# EasyEDA Pro project RealisticPM_2026-10-08.epro, board PCB
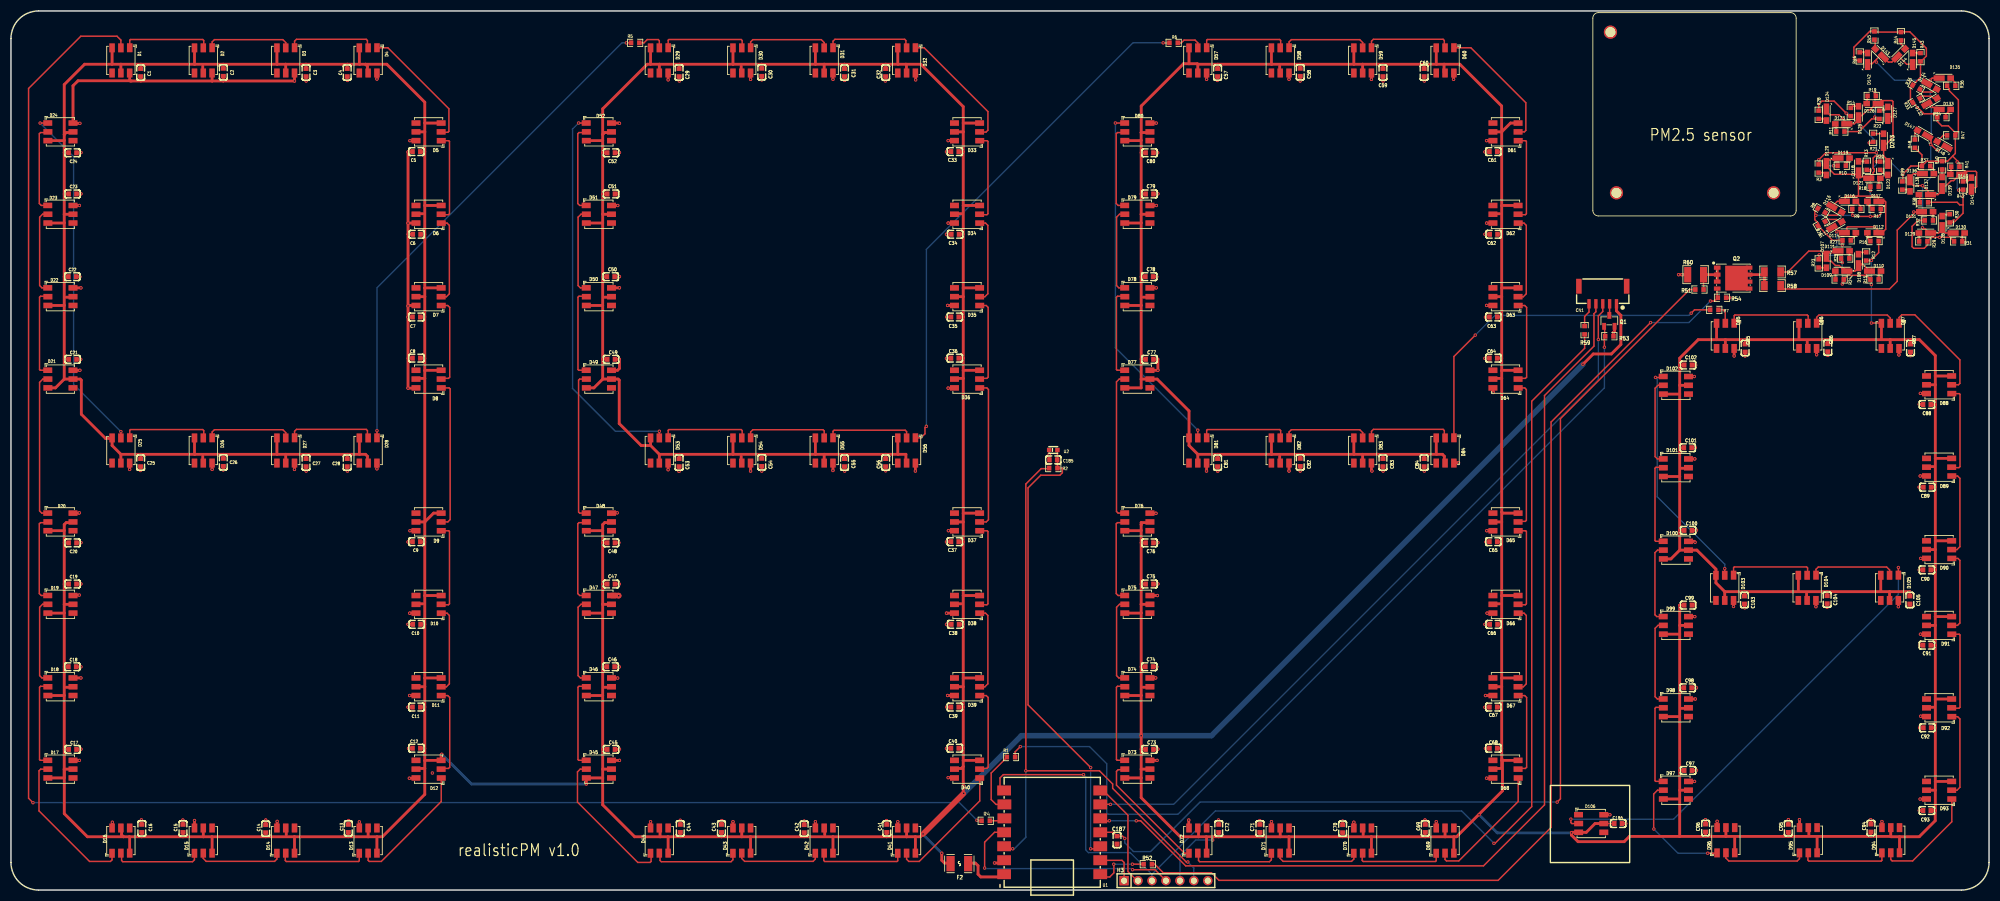
[diagram p4: board, top side]
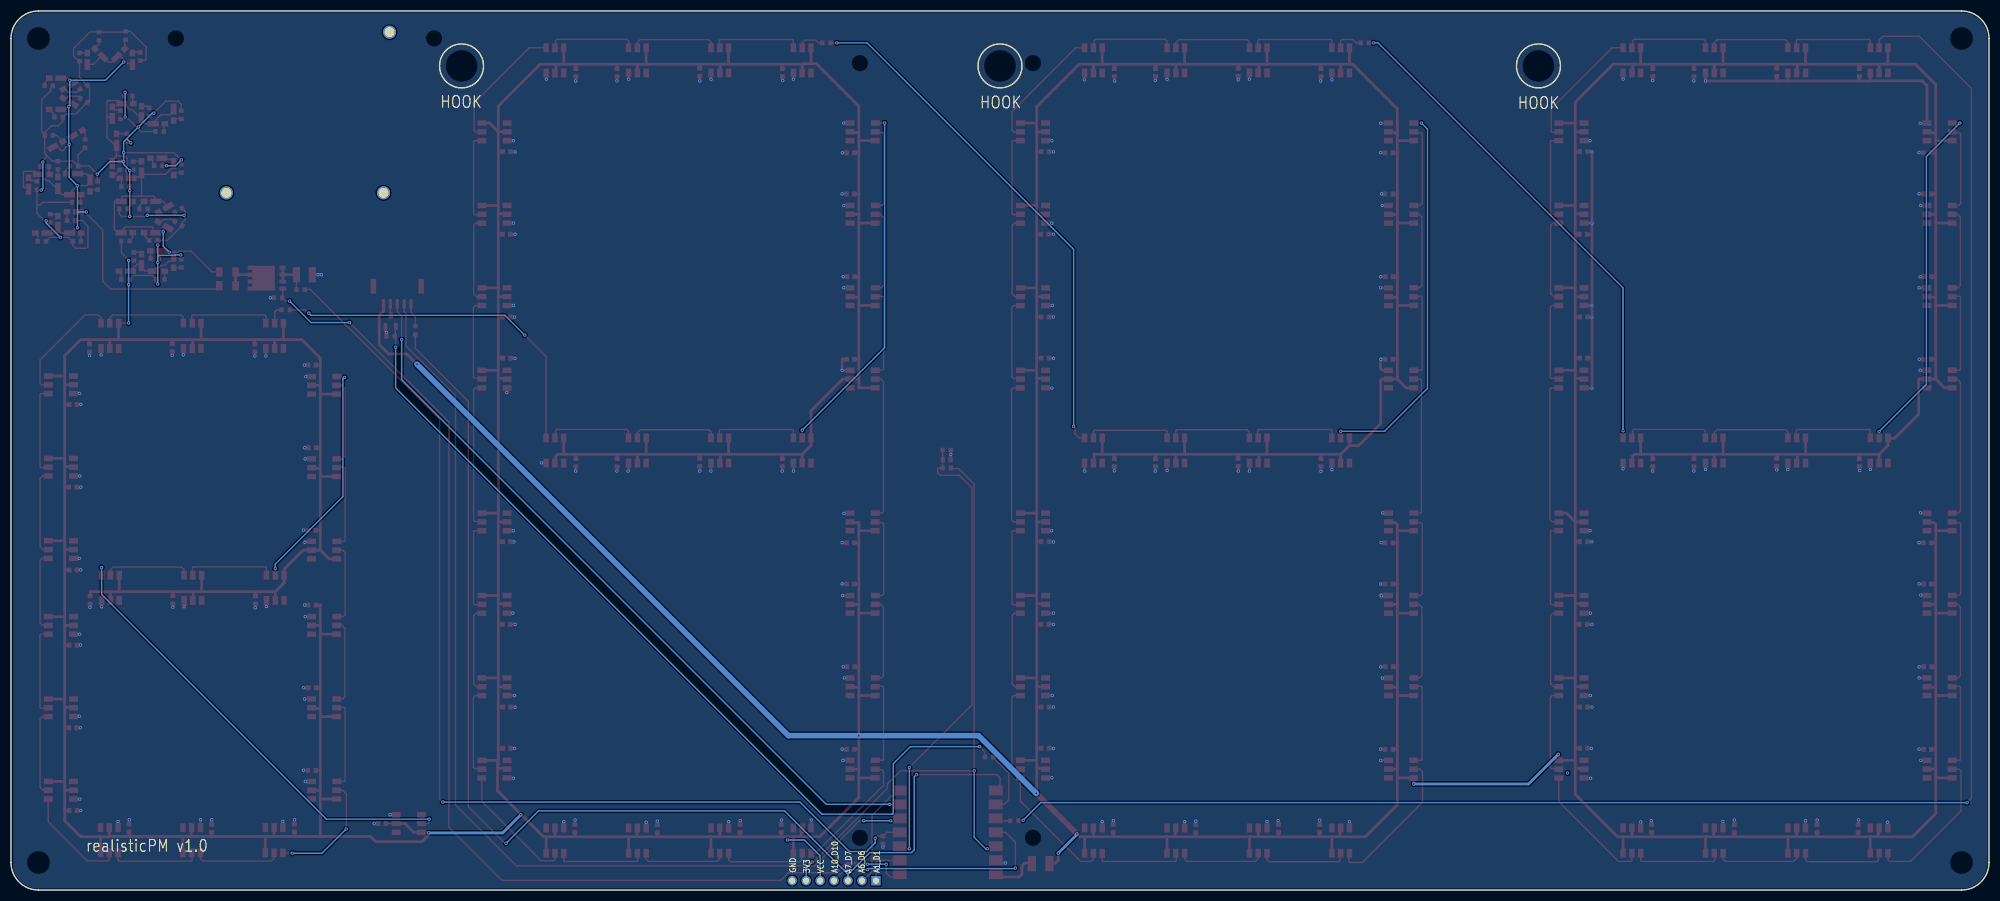
[diagram p5: board, bottom side, seen from below]

Outline 360 x 160 mm; copper layers: Top Layer, Bottom Layer. Coordinates in mm from the lower left corner of the outline.
Outline path: 0,155 0,5 arc(1.46,1.46) 5,0 355,0 arc(358.54,1.46) 360,5 360,155 arc(358.54,158.54) 355,160 5,160 arc(1.46,158.54) 0,155
Stack: Top Layer 0.035mm / Dielectric1 1.51mm FR4 er 4.5 / Bottom Layer 0.035mm

## Design rules (mm)
spacing copperThickness1oz (default): track to track 0.102, other pairs 0.152 to 0.3
spacing copperThickness2oz: track to track 0.203, other pairs 0.152 to 0.3
spacing Plane_innerPlane: track to track 0.102, other pairs 0.152 to 0.3
spacing Copper_copperRegion: track to track 0.102, other pairs 0.152 to 0.3
track width copperThickness1oz (default): min 0.127, default 0.254, max 2.54
track width copperThickness2oz: min 0.203, default 0.254, max 2.54
differential pair differentialPair (default): width min 0.127, default 0.254, max 2.54; gap min 0.152, default 0.152
pour e2951 uses Copper_copperRegion

## Placement (name value [footprint] x y rotation side)
C1  100nF  [C0603]  23.6 148.78 270 top
C2  100nF  [C0603]  38.64 148.84 270 top
C3  100nF  [C0603]  53.7 148.78 270 top
C4  100nF  [C0603]  61.19 148.78 270 top
C5  100nF  [C0603]  73.78 134.4 180 top
C6  100nF  [C0603]  73.84 119.36 180 top
C7  100nF  [C0603]  73.78 104.3 180 top
C8  100nF  [C0603]  73.78 96.81 180 top
C9  100nF  [C0603]  73.78 63.4 180 top
C10  100nF  [C0603]  73.84 48.36 180 top
C11  100nF  [C0603]  73.78 33.3 180 top
C12  100nF  [C0603]  73.78 25.81 180 top
C13  100nF  [C0603]  61.4 11.22 90 top
C14  100nF  [C0603]  46.36 11.16 90 top
C15  100nF  [C0603]  31.3 11.22 90 top
C16  100nF  [C0603]  23.81 11.22 90 top
C17  100nF  [C0603]  11.21 25.6 0 top
C18  100nF  [C0603]  11.16 40.64 0 top
C19  100nF  [C0603]  11.21 55.7 0 top
C20  100nF  [C0603]  11.21 63.19 0 top
C21  100nF  [C0603]  11.21 96.6 0 top
C22  100nF  [C0603]  11.16 111.64 0 top
C23  100nF  [C0603]  11.21 126.7 0 top
C24  100nF  [C0603]  11.21 134.19 0 top
C25  100nF  [C0603]  23.6 77.78 270 top
C26  100nF  [C0603]  38.64 77.84 270 top
C27  100nF  [C0603]  53.7 77.78 270 top
C28  100nF  [C0603]  61.19 77.78 270 top
C29  100nF  [C0603]  121.6 148.78 270 top
C30  100nF  [C0603]  136.64 148.84 270 top
C31  100nF  [C0603]  151.7 148.78 270 top
C32  100nF  [C0603]  159.19 148.78 270 top
C33  100nF  [C0603]  171.78 134.4 180 top
C34  100nF  [C0603]  171.84 119.36 180 top
C35  100nF  [C0603]  171.78 104.3 180 top
C36  100nF  [C0603]  171.78 96.81 180 top
C37  100nF  [C0603]  171.78 63.4 180 top
C38  100nF  [C0603]  171.84 48.36 180 top
C39  100nF  [C0603]  171.78 33.3 180 top
C40  100nF  [C0603]  171.78 25.81 180 top
C41  100nF  [C0603]  159.4 11.22 90 top
C42  100nF  [C0603]  144.36 11.16 90 top
C43  100nF  [C0603]  129.3 11.22 90 top
C44  100nF  [C0603]  121.81 11.22 90 top
C45  100nF  [C0603]  109.22 25.6 0 top
C46  100nF  [C0603]  109.16 40.64 0 top
C47  100nF  [C0603]  109.22 55.7 0 top
C48  100nF  [C0603]  109.22 63.19 0 top
C49  100nF  [C0603]  109.22 96.6 0 top
C50  100nF  [C0603]  109.16 111.64 0 top
C51  100nF  [C0603]  109.22 126.7 0 top
C52  100nF  [C0603]  109.22 134.19 0 top
C53  100nF  [C0603]  121.6 77.78 270 top
C54  100nF  [C0603]  136.64 77.84 270 top
C55  100nF  [C0603]  151.7 77.78 270 top
C56  100nF  [C0603]  159.19 77.78 270 top
C57  100nF  [C0603]  219.6 148.78 270 top
C58  100nF  [C0603]  234.64 148.84 270 top
C59  100nF  [C0603]  249.7 148.78 270 top
C60  100nF  [C0603]  257.19 148.78 270 top
C61  100nF  [C0603]  269.78 134.4 180 top
C62  100nF  [C0603]  269.84 119.36 180 top
C63  100nF  [C0603]  269.78 104.3 180 top
C64  100nF  [C0603]  269.78 96.81 180 top
C65  100nF  [C0603]  269.78 63.4 180 top
C66  100nF  [C0603]  269.84 48.36 180 top
C67  100nF  [C0603]  269.78 33.3 180 top
C68  100nF  [C0603]  269.78 25.81 180 top
C69  100nF  [C0603]  257.4 11.22 90 top
C70  100nF  [C0603]  242.36 11.16 90 top
C71  100nF  [C0603]  227.3 11.22 90 top
C72  100nF  [C0603]  219.81 11.22 90 top
C73  100nF  [C0603]  207.22 25.6 0 top
C74  100nF  [C0603]  207.16 40.64 0 top
C75  100nF  [C0603]  207.22 55.7 0 top
C76  100nF  [C0603]  207.22 63.19 0 top
C77  100nF  [C0603]  207.22 96.6 0 top
C78  100nF  [C0603]  207.16 111.64 0 top
C79  100nF  [C0603]  207.22 126.7 0 top
C80  100nF  [C0603]  207.22 134.19 0 top
C81  100nF  [C0603]  219.6 77.78 270 top
C82  100nF  [C0603]  234.64 77.84 270 top
C83  100nF  [C0603]  249.7 77.78 270 top
C84  100nF  [C0603]  257.19 77.78 270 top
C85  100nF  [C0603]  315.61 98.65 270 top
C86  100nF  [C0603]  330.66 98.71 270 top
C87  100nF  [C0603]  345.71 98.65 270 top
C88  100nF  [C0603]  348.7 88.37 180 top
C89  100nF  [C0603]  348.76 73.32 180 top
C90  100nF  [C0603]  348.7 58.27 180 top
C91  100nF  [C0603]  348.7 44.57 180 top
C92  100nF  [C0603]  348.76 29.52 180 top
C93  100nF  [C0603]  348.7 14.47 180 top
C94  100nF  [C0603]  338.52 11.28 90 top
C95  100nF  [C0603]  323.47 11.22 90 top
C96  100nF  [C0603]  308.42 11.28 90 top
C97  100nF  [C0603]  305.23 21.76 0 top
C98  100nF  [C0603]  305.17 36.81 0 top
C99  100nF  [C0603]  305.23 51.86 0 top
C100  100nF  [C0603]  305.23 65.46 0 top
C101  100nF  [C0603]  305.17 80.51 0 top
C102  100nF  [C0603]  305.23 95.56 0 top
C103  100nF  [C0603]  315.5 52.78 270 top
C104  100nF  [C0603]  330.54 52.84 270 top
C105  100nF  [C0603]  345.6 52.78 270 top
C185  100nF  [C0603]  189.7 78.3 0 top
C186  100nF  [C0603]  292.5 12.1 0 top
C187  100nF  [C0603]  201.3 9.1 90 top
CN1  SM05B-GHS-TB  [CONN-SMD_5P-P1.25_SM05B-GHS-TB]  289.7 108.3 180 top
D1  IN-PI55TBTPRPGPB  [LED-SMD_6P-L5.0-W5.0-P1.60-LS5.4_A-SC5050ARGBC-B01-03-1T]  20 151 270 top
D2  IN-PI55TBTPRPGPB  [LED-SMD_6P-L5.0-W5.0-P1.60-LS5.4_A-SC5050ARGBC-B01-03-1T]  35 151 270 top
D3  IN-PI55TBTPRPGPB  [LED-SMD_6P-L5.0-W5.0-P1.60-LS5.4_A-SC5050ARGBC-B01-03-1T]  50 151 270 top
D4  IN-PI55TBTPRPGPB  [LED-SMD_6P-L5.0-W5.0-P1.60-LS5.4_A-SC5050ARGBC-B01-03-1T]  65 151 270 top
D5  IN-PI55TBTPRPGPB  [LED-SMD_6P-L5.0-W5.0-P1.60-LS5.4_A-SC5050ARGBC-B01-03-1T]  76 138 180 top
D6  IN-PI55TBTPRPGPB  [LED-SMD_6P-L5.0-W5.0-P1.60-LS5.4_A-SC5050ARGBC-B01-03-1T]  76 123 180 top
D7  IN-PI55TBTPRPGPB  [LED-SMD_6P-L5.0-W5.0-P1.60-LS5.4_A-SC5050ARGBC-B01-03-1T]  76 108 180 top
D8  IN-PI55TBTPRPGPB  [LED-SMD_6P-L5.0-W5.0-P1.60-LS5.4_A-SC5050ARGBC-B01-03-1T]  76 93 180 top
D9  IN-PI55TBTPRPGPB  [LED-SMD_6P-L5.0-W5.0-P1.60-LS5.4_A-SC5050ARGBC-B01-03-1T]  76 67 180 top
D10  IN-PI55TBTPRPGPB  [LED-SMD_6P-L5.0-W5.0-P1.60-LS5.4_A-SC5050ARGBC-B01-03-1T]  76 52 180 top
D11  IN-PI55TBTPRPGPB  [LED-SMD_6P-L5.0-W5.0-P1.60-LS5.4_A-SC5050ARGBC-B01-03-1T]  76 37 180 top
D12  IN-PI55TBTPRPGPB  [LED-SMD_6P-L5.0-W5.0-P1.60-LS5.4_A-SC5050ARGBC-B01-03-1T]  76 22 180 top
D13  IN-PI55TBTPRPGPB  [LED-SMD_6P-L5.0-W5.0-P1.60-LS5.4_A-SC5050ARGBC-B01-03-1T]  65 9 90 top
D14  IN-PI55TBTPRPGPB  [LED-SMD_6P-L5.0-W5.0-P1.60-LS5.4_A-SC5050ARGBC-B01-03-1T]  50 9 90 top
D15  IN-PI55TBTPRPGPB  [LED-SMD_6P-L5.0-W5.0-P1.60-LS5.4_A-SC5050ARGBC-B01-03-1T]  35 9 90 top
D16  IN-PI55TBTPRPGPB  [LED-SMD_6P-L5.0-W5.0-P1.60-LS5.4_A-SC5050ARGBC-B01-03-1T]  20 9 90 top
D17  IN-PI55TBTPRPGPB  [LED-SMD_6P-L5.0-W5.0-P1.60-LS5.4_A-SC5050ARGBC-B01-03-1T]  9 22 0 top
D18  IN-PI55TBTPRPGPB  [LED-SMD_6P-L5.0-W5.0-P1.60-LS5.4_A-SC5050ARGBC-B01-03-1T]  9 37 0 top
D19  IN-PI55TBTPRPGPB  [LED-SMD_6P-L5.0-W5.0-P1.60-LS5.4_A-SC5050ARGBC-B01-03-1T]  9 52 0 top
D20  IN-PI55TBTPRPGPB  [LED-SMD_6P-L5.0-W5.0-P1.60-LS5.4_A-SC5050ARGBC-B01-03-1T]  9 67 0 top
D21  IN-PI55TBTPRPGPB  [LED-SMD_6P-L5.0-W5.0-P1.60-LS5.4_A-SC5050ARGBC-B01-03-1T]  9 93 0 top
D22  IN-PI55TBTPRPGPB  [LED-SMD_6P-L5.0-W5.0-P1.60-LS5.4_A-SC5050ARGBC-B01-03-1T]  9 108 0 top
D23  IN-PI55TBTPRPGPB  [LED-SMD_6P-L5.0-W5.0-P1.60-LS5.4_A-SC5050ARGBC-B01-03-1T]  9 123 0 top
D24  IN-PI55TBTPRPGPB  [LED-SMD_6P-L5.0-W5.0-P1.60-LS5.4_A-SC5050ARGBC-B01-03-1T]  9 138 0 top
D25  IN-PI55TBTPRPGPB  [LED-SMD_6P-L5.0-W5.0-P1.60-LS5.4_A-SC5050ARGBC-B01-03-1T]  20 80 270 top
D26  IN-PI55TBTPRPGPB  [LED-SMD_6P-L5.0-W5.0-P1.60-LS5.4_A-SC5050ARGBC-B01-03-1T]  35 80 270 top
D27  IN-PI55TBTPRPGPB  [LED-SMD_6P-L5.0-W5.0-P1.60-LS5.4_A-SC5050ARGBC-B01-03-1T]  50 80 270 top
D28  IN-PI55TBTPRPGPB  [LED-SMD_6P-L5.0-W5.0-P1.60-LS5.4_A-SC5050ARGBC-B01-03-1T]  65 80 270 top
D29  IN-PI55TBTPRPGPB  [LED-SMD_6P-L5.0-W5.0-P1.60-LS5.4_A-SC5050ARGBC-B01-03-1T]  118 151 270 top
D30  IN-PI55TBTPRPGPB  [LED-SMD_6P-L5.0-W5.0-P1.60-LS5.4_A-SC5050ARGBC-B01-03-1T]  133 151 270 top
D31  IN-PI55TBTPRPGPB  [LED-SMD_6P-L5.0-W5.0-P1.60-LS5.4_A-SC5050ARGBC-B01-03-1T]  148 151 270 top
D32  IN-PI55TBTPRPGPB  [LED-SMD_6P-L5.0-W5.0-P1.60-LS5.4_A-SC5050ARGBC-B01-03-1T]  163 151 270 top
D33  IN-PI55TBTPRPGPB  [LED-SMD_6P-L5.0-W5.0-P1.60-LS5.4_A-SC5050ARGBC-B01-03-1T]  174 138 180 top
D34  IN-PI55TBTPRPGPB  [LED-SMD_6P-L5.0-W5.0-P1.60-LS5.4_A-SC5050ARGBC-B01-03-1T]  174 123 180 top
D35  IN-PI55TBTPRPGPB  [LED-SMD_6P-L5.0-W5.0-P1.60-LS5.4_A-SC5050ARGBC-B01-03-1T]  174 108 180 top
D36  IN-PI55TBTPRPGPB  [LED-SMD_6P-L5.0-W5.0-P1.60-LS5.4_A-SC5050ARGBC-B01-03-1T]  174 93 180 top
D37  IN-PI55TBTPRPGPB  [LED-SMD_6P-L5.0-W5.0-P1.60-LS5.4_A-SC5050ARGBC-B01-03-1T]  174 67 180 top
D38  IN-PI55TBTPRPGPB  [LED-SMD_6P-L5.0-W5.0-P1.60-LS5.4_A-SC5050ARGBC-B01-03-1T]  174 52 180 top
D39  IN-PI55TBTPRPGPB  [LED-SMD_6P-L5.0-W5.0-P1.60-LS5.4_A-SC5050ARGBC-B01-03-1T]  174 37 180 top
D40  IN-PI55TBTPRPGPB  [LED-SMD_6P-L5.0-W5.0-P1.60-LS5.4_A-SC5050ARGBC-B01-03-1T]  174 22 180 top
D41  IN-PI55TBTPRPGPB  [LED-SMD_6P-L5.0-W5.0-P1.60-LS5.4_A-SC5050ARGBC-B01-03-1T]  163 9 90 top
D42  IN-PI55TBTPRPGPB  [LED-SMD_6P-L5.0-W5.0-P1.60-LS5.4_A-SC5050ARGBC-B01-03-1T]  148 9 90 top
D43  IN-PI55TBTPRPGPB  [LED-SMD_6P-L5.0-W5.0-P1.60-LS5.4_A-SC5050ARGBC-B01-03-1T]  133 9 90 top
D44  IN-PI55TBTPRPGPB  [LED-SMD_6P-L5.0-W5.0-P1.60-LS5.4_A-SC5050ARGBC-B01-03-1T]  118 9 90 top
D45  IN-PI55TBTPRPGPB  [LED-SMD_6P-L5.0-W5.0-P1.60-LS5.4_A-SC5050ARGBC-B01-03-1T]  107 22 0 top
D46  IN-PI55TBTPRPGPB  [LED-SMD_6P-L5.0-W5.0-P1.60-LS5.4_A-SC5050ARGBC-B01-03-1T]  107 37 0 top
D47  IN-PI55TBTPRPGPB  [LED-SMD_6P-L5.0-W5.0-P1.60-LS5.4_A-SC5050ARGBC-B01-03-1T]  107 52 0 top
D48  IN-PI55TBTPRPGPB  [LED-SMD_6P-L5.0-W5.0-P1.60-LS5.4_A-SC5050ARGBC-B01-03-1T]  107 67 0 top
D49  IN-PI55TBTPRPGPB  [LED-SMD_6P-L5.0-W5.0-P1.60-LS5.4_A-SC5050ARGBC-B01-03-1T]  107 93 0 top
D50  IN-PI55TBTPRPGPB  [LED-SMD_6P-L5.0-W5.0-P1.60-LS5.4_A-SC5050ARGBC-B01-03-1T]  107 108 0 top
D51  IN-PI55TBTPRPGPB  [LED-SMD_6P-L5.0-W5.0-P1.60-LS5.4_A-SC5050ARGBC-B01-03-1T]  107 123 0 top
D52  IN-PI55TBTPRPGPB  [LED-SMD_6P-L5.0-W5.0-P1.60-LS5.4_A-SC5050ARGBC-B01-03-1T]  107 138 0 top
D53  IN-PI55TBTPRPGPB  [LED-SMD_6P-L5.0-W5.0-P1.60-LS5.4_A-SC5050ARGBC-B01-03-1T]  118 80 270 top
D54  IN-PI55TBTPRPGPB  [LED-SMD_6P-L5.0-W5.0-P1.60-LS5.4_A-SC5050ARGBC-B01-03-1T]  133 80 270 top
D55  IN-PI55TBTPRPGPB  [LED-SMD_6P-L5.0-W5.0-P1.60-LS5.4_A-SC5050ARGBC-B01-03-1T]  148 80 270 top
D56  IN-PI55TBTPRPGPB  [LED-SMD_6P-L5.0-W5.0-P1.60-LS5.4_A-SC5050ARGBC-B01-03-1T]  163 80 270 top
D57  IN-PI55TBTPRPGPB  [LED-SMD_6P-L5.0-W5.0-P1.60-LS5.4_A-SC5050ARGBC-B01-03-1T]  216 151 270 top
D58  IN-PI55TBTPRPGPB  [LED-SMD_6P-L5.0-W5.0-P1.60-LS5.4_A-SC5050ARGBC-B01-03-1T]  231 151 270 top
D59  IN-PI55TBTPRPGPB  [LED-SMD_6P-L5.0-W5.0-P1.60-LS5.4_A-SC5050ARGBC-B01-03-1T]  246 151 270 top
D60  IN-PI55TBTPRPGPB  [LED-SMD_6P-L5.0-W5.0-P1.60-LS5.4_A-SC5050ARGBC-B01-03-1T]  261 151 270 top
D61  IN-PI55TBTPRPGPB  [LED-SMD_6P-L5.0-W5.0-P1.60-LS5.4_A-SC5050ARGBC-B01-03-1T]  272 138 180 top
D62  IN-PI55TBTPRPGPB  [LED-SMD_6P-L5.0-W5.0-P1.60-LS5.4_A-SC5050ARGBC-B01-03-1T]  272 123 180 top
D63  IN-PI55TBTPRPGPB  [LED-SMD_6P-L5.0-W5.0-P1.60-LS5.4_A-SC5050ARGBC-B01-03-1T]  272 108 180 top
D64  IN-PI55TBTPRPGPB  [LED-SMD_6P-L5.0-W5.0-P1.60-LS5.4_A-SC5050ARGBC-B01-03-1T]  272 93 180 top
D65  IN-PI55TBTPRPGPB  [LED-SMD_6P-L5.0-W5.0-P1.60-LS5.4_A-SC5050ARGBC-B01-03-1T]  272 67 180 top
D66  IN-PI55TBTPRPGPB  [LED-SMD_6P-L5.0-W5.0-P1.60-LS5.4_A-SC5050ARGBC-B01-03-1T]  272 52 180 top
D67  IN-PI55TBTPRPGPB  [LED-SMD_6P-L5.0-W5.0-P1.60-LS5.4_A-SC5050ARGBC-B01-03-1T]  272 37 180 top
D68  IN-PI55TBTPRPGPB  [LED-SMD_6P-L5.0-W5.0-P1.60-LS5.4_A-SC5050ARGBC-B01-03-1T]  272 22 180 top
D69  IN-PI55TBTPRPGPB  [LED-SMD_6P-L5.0-W5.0-P1.60-LS5.4_A-SC5050ARGBC-B01-03-1T]  261 9 90 top
D70  IN-PI55TBTPRPGPB  [LED-SMD_6P-L5.0-W5.0-P1.60-LS5.4_A-SC5050ARGBC-B01-03-1T]  246 9 90 top
D71  IN-PI55TBTPRPGPB  [LED-SMD_6P-L5.0-W5.0-P1.60-LS5.4_A-SC5050ARGBC-B01-03-1T]  231 9 90 top
D72  IN-PI55TBTPRPGPB  [LED-SMD_6P-L5.0-W5.0-P1.60-LS5.4_A-SC5050ARGBC-B01-03-1T]  216 9 90 top
D73  IN-PI55TBTPRPGPB  [LED-SMD_6P-L5.0-W5.0-P1.60-LS5.4_A-SC5050ARGBC-B01-03-1T]  205 22 0 top
D74  IN-PI55TBTPRPGPB  [LED-SMD_6P-L5.0-W5.0-P1.60-LS5.4_A-SC5050ARGBC-B01-03-1T]  205 37 0 top
D75  IN-PI55TBTPRPGPB  [LED-SMD_6P-L5.0-W5.0-P1.60-LS5.4_A-SC5050ARGBC-B01-03-1T]  205 52 0 top
D76  IN-PI55TBTPRPGPB  [LED-SMD_6P-L5.0-W5.0-P1.60-LS5.4_A-SC5050ARGBC-B01-03-1T]  205 67 0 top
D77  IN-PI55TBTPRPGPB  [LED-SMD_6P-L5.0-W5.0-P1.60-LS5.4_A-SC5050ARGBC-B01-03-1T]  205 93 0 top
D78  IN-PI55TBTPRPGPB  [LED-SMD_6P-L5.0-W5.0-P1.60-LS5.4_A-SC5050ARGBC-B01-03-1T]  205 108 0 top
D79  IN-PI55TBTPRPGPB  [LED-SMD_6P-L5.0-W5.0-P1.60-LS5.4_A-SC5050ARGBC-B01-03-1T]  205 123 0 top
D80  IN-PI55TBTPRPGPB  [LED-SMD_6P-L5.0-W5.0-P1.60-LS5.4_A-SC5050ARGBC-B01-03-1T]  205 138 0 top
D81  IN-PI55TBTPRPGPB  [LED-SMD_6P-L5.0-W5.0-P1.60-LS5.4_A-SC5050ARGBC-B01-03-1T]  216 80 270 top
D82  IN-PI55TBTPRPGPB  [LED-SMD_6P-L5.0-W5.0-P1.60-LS5.4_A-SC5050ARGBC-B01-03-1T]  231 80 270 top
D83  IN-PI55TBTPRPGPB  [LED-SMD_6P-L5.0-W5.0-P1.60-LS5.4_A-SC5050ARGBC-B01-03-1T]  246 80 270 top
D84  IN-PI55TBTPRPGPB  [LED-SMD_6P-L5.0-W5.0-P1.60-LS5.4_A-SC5050ARGBC-B01-03-1T]  261 80 270 top
D85  IN-PI55TBTPRPGPB  [LED-SMD_6P-L5.0-W5.0-P1.60-LS5.4_A-SC5050ARGBC-B01-03-1T]  312.01 100.86 270 top
D86  IN-PI55TBTPRPGPB  [LED-SMD_6P-L5.0-W5.0-P1.60-LS5.4_A-SC5050ARGBC-B01-03-1T]  327.01 100.86 270 top
D87  IN-PI55TBTPRPGPB  [LED-SMD_6P-L5.0-W5.0-P1.60-LS5.4_A-SC5050ARGBC-B01-03-1T]  342.01 100.86 270 top
D88  IN-PI55TBTPRPGPB  [LED-SMD_6P-L5.0-W5.0-P1.60-LS5.4_A-SC5050ARGBC-B01-03-1T]  350.92 91.97 180 top
D89  IN-PI55TBTPRPGPB  [LED-SMD_6P-L5.0-W5.0-P1.60-LS5.4_A-SC5050ARGBC-B01-03-1T]  350.92 76.97 180 top
D90  IN-PI55TBTPRPGPB  [LED-SMD_6P-L5.0-W5.0-P1.60-LS5.4_A-SC5050ARGBC-B01-03-1T]  350.92 61.97 180 top
D91  IN-PI55TBTPRPGPB  [LED-SMD_6P-L5.0-W5.0-P1.60-LS5.4_A-SC5050ARGBC-B01-03-1T]  350.92 48.16 180 top
D92  IN-PI55TBTPRPGPB  [LED-SMD_6P-L5.0-W5.0-P1.60-LS5.4_A-SC5050ARGBC-B01-03-1T]  350.92 33.16 180 top
D93  IN-PI55TBTPRPGPB  [LED-SMD_6P-L5.0-W5.0-P1.60-LS5.4_A-SC5050ARGBC-B01-03-1T]  350.92 18.16 180 top
D94  IN-PI55TBTPRPGPB  [LED-SMD_6P-L5.0-W5.0-P1.60-LS5.4_A-SC5050ARGBC-B01-03-1T]  342.12 9.06 90 top
D95  IN-PI55TBTPRPGPB  [LED-SMD_6P-L5.0-W5.0-P1.60-LS5.4_A-SC5050ARGBC-B01-03-1T]  327.12 9.06 90 top
D96  IN-PI55TBTPRPGPB  [LED-SMD_6P-L5.0-W5.0-P1.60-LS5.4_A-SC5050ARGBC-B01-03-1T]  312.12 9.06 90 top
D97  IN-PI55TBTPRPGPB  [LED-SMD_6P-L5.0-W5.0-P1.60-LS5.4_A-SC5050ARGBC-B01-03-1T]  303.01 18.16 0 top
D98  IN-PI55TBTPRPGPB  [LED-SMD_6P-L5.0-W5.0-P1.60-LS5.4_A-SC5050ARGBC-B01-03-1T]  303.01 33.16 0 top
D99  IN-PI55TBTPRPGPB  [LED-SMD_6P-L5.0-W5.0-P1.60-LS5.4_A-SC5050ARGBC-B01-03-1T]  303.01 48.16 0 top
D100  IN-PI55TBTPRPGPB  [LED-SMD_6P-L5.0-W5.0-P1.60-LS5.4_A-SC5050ARGBC-B01-03-1T]  303.01 61.86 0 top
D101  IN-PI55TBTPRPGPB  [LED-SMD_6P-L5.0-W5.0-P1.60-LS5.4_A-SC5050ARGBC-B01-03-1T]  303.01 76.86 0 top
D102  IN-PI55TBTPRPGPB  [LED-SMD_6P-L5.0-W5.0-P1.60-LS5.4_A-SC5050ARGBC-B01-03-1T]  303.01 91.86 0 top
D103  IN-PI55TBTPRPGPB  [LED-SMD_6P-L5.0-W5.0-P1.60-LS5.4_A-SC5050ARGBC-B01-03-1T]  311.9 55 270 top
D104  IN-PI55TBTPRPGPB  [LED-SMD_6P-L5.0-W5.0-P1.60-LS5.4_A-SC5050ARGBC-B01-03-1T]  326.9 55 270 top
D105  IN-PI55TBTPRPGPB  [LED-SMD_6P-L5.0-W5.0-P1.60-LS5.4_A-SC5050ARGBC-B01-03-1T]  341.9 55 270 top
D106  IN-PI55TBTPRPGPB  [LED-SMD_6P-L5.0-W5.0-P1.60-LS5.4_A-SC5050ARGBC-B01-03-1T]  287.6 12.1 0 top
D107  GW JCLPS2.CM-GVH3-A131-1-65-2-R33  [LED-SMD_L3.0-W1.4-RD]  330.4 114.31 270 top
D108  GW JCLPS2.CM-GVH3-A131-1-65-2-R33  [LED-SMD_L3.0-W1.4-RD]  336.24 114.69 90 top
D109  GW JCLPS2.CM-GVH3-A131-1-65-2-R33  [LED-SMD_L3.0-W1.4-RD]  333.07 112.66 180 top
D110  GW JCLPS2.CM-GVH3-A131-1-65-2-R33  [LED-SMD_L3.0-W1.4-RD]  339.29 112.66 0 top
D111  GW JCLPS2.CM-GVH3-A131-1-65-2-R33  [LED-SMD_L3.0-W1.4-RD]  333.57 116.34 0 top
D112  GW JCLPS2.CM-GVH3-A131-1-65-2-R33  [LED-SMD_L3.0-W1.4-RD]  338.91 119.64 180 top
D113  GW JCLPS2.CM-GVH3-A131-1-65-2-R33  [LED-SMD_L3.0-W1.4-RD]  332.3 121.1 30 top
D114  GW JCLPS2.CM-GVH3-A131-1-65-2-R33  [LED-SMD_L3.0-W1.4-RD]  334.72 119.64 0 top
D115  GW JCLPS2.CM-GVH3-A131-1-65-2-R33  [LED-SMD_L3.0-W1.4-RD]  332.3 123.9 330 top
D116  GW JCLPS2.CM-GVH3-A131-1-65-2-R33  [LED-SMD_L3.0-W1.4-RD]  334.72 125.36 0 top
D117  GW JCLPS2.CM-GVH3-A131-1-65-2-R33  [LED-SMD_L3.0-W1.4-RD]  338.91 125.36 180 top
D118  GW JCLPS2.CM-GVH3-A131-1-65-2-R33  [LED-SMD_L3.0-W1.4-RD]  336.24 131.58 90 top
D119  GW JCLPS2.CM-GVH3-A131-1-65-2-R33  [LED-SMD_L3.0-W1.4-RD]  333.57 133.23 0 top
D120  GW JCLPS2.CM-GVH3-A131-1-65-2-R33  [LED-SMD_L3.0-W1.4-RD]  330.4 131.2 270 top
D121  GW JCLPS2.CM-GVH3-A131-1-65-2-R33  [LED-SMD_L3.0-W1.4-RD]  339.16 129.55 0 top
D122  GW JCLPS2.CM-GVH3-A131-1-65-2-R33  [LED-SMD_L3.0-W1.4-RD]  341.58 131.2 270 top
D123  GW JCLPS2.CM-GVH3-A131-1-65-2-R33  [LED-SMD_L3.0-W1.4-RD]  333.07 139.45 180 top
D124  GW JCLPS2.CM-GVH3-A131-1-65-2-R33  [LED-SMD_L3.0-W1.4-RD]  330.4 141.11 270 top
D125  GW JCLPS2.CM-GVH3-A131-1-65-2-R33  [LED-SMD_L3.0-W1.4-RD]  336.24 141.61 90 top
D126  GW JCLPS2.CM-GVH3-A131-1-65-2-R33  [LED-SMD_L3.0-W1.4-RD]  338.78 143.14 180 top
D127  GW JCLPS2.CM-GVH3-A131-1-65-2-R33  [LED-SMD_L3.0-W1.4-RD]  341.58 141.49 90 top
D128  GW JCLPS2.CM-GVH3-A131-1-65-2-R33  [LED-SMD_L3.0-W1.4-RD]  351.46 121.62 90 top
D129  GW JCLPS2.CM-GVH3-A131-1-65-2-R33  [LED-SMD_L3.0-W1.4-RD]  348.29 119.59 180 top
D130  GW JCLPS2.CM-GVH3-A131-1-65-2-R33  [LED-SMD_L3.0-W1.4-RD]  354.51 119.59 0 top
D131  GW JCLPS2.CM-GVH3-A131-1-65-2-R33  [LED-SMD_L3.0-W1.4-RD]  348.77 123.46 0 top
D132  GW JCLPS2.CM-GVH3-A131-1-65-2-R33  [LED-SMD_L3.0-W1.4-RD]  349.6 143.6 30 top
D133  GW JCLPS2.CM-GVH3-A131-1-65-2-R33  [LED-SMD_L3.0-W1.4-RD]  351.97 142.07 0 top
D134  GW JCLPS2.CM-GVH3-A131-1-65-2-R33  [LED-SMD_L3.0-W1.4-RD]  349.6 146.3 330 top
D135  GW JCLPS2.CM-GVH3-A131-1-65-2-R33  [LED-SMD_L3.0-W1.4-RD]  351.97 147.78 0 top
D136  GW JCLPS2.CM-GVH3-A131-1-65-2-R33  [LED-SMD_L3.0-W1.4-RD]  348.93 130.39 0 top
D137  GW JCLPS2.CM-GVH3-A131-1-65-2-R33  [LED-SMD_L3.0-W1.4-RD]  348.29 126.58 180 top
D138  GW JCLPS2.CM-GVH3-A131-1-65-2-R33  [LED-SMD_L3.0-W1.4-RD]  345.62 128.23 270 top
D139  GW JCLPS2.CM-GVH3-A131-1-65-2-R33  [LED-SMD_L3.0-W1.4-RD]  351.46 128.73 90 top
D140  GW JCLPS2.CM-GVH3-A131-1-65-2-R33  [LED-SMD_L3.0-W1.4-RD]  354 130.26 180 top
D141  GW JCLPS2.CM-GVH3-A131-1-65-2-R33  [LED-SMD_L3.0-W1.4-RD]  356.8 128.61 90 top
D142  GW JCLPS2.CM-GVH3-A131-1-65-2-R33  [LED-SMD_L3.0-W1.4-RD]  337.9 151.3 90 top
D143  GW JCLPS2.CM-GVH3-A131-1-65-2-R33  [LED-SMD_L3.0-W1.4-RD]  340.04 152.36 135 top
D144  GW JCLPS2.CM-GVH3-A131-1-65-2-R33  [LED-SMD_L3.0-W1.4-RD]  343.97 152.36 45 top
D145  GW JCLPS2.CM-GVH3-A131-1-65-2-R33  [LED-SMD_L3.0-W1.4-RD]  346.1 151.3 90 top
D146  GW JCLPS2.CM-GVH3-A131-1-65-2-R33  [LED-SMD_L3.0-W1.4-RD]  351.46 135.72 150 top
D147  GW JCLPS2.CM-GVH3-A131-1-65-2-R33  [LED-SMD_L3.0-W1.4-RD]  347.91 137.75 150 top
D203  GW JCLPS2.CM-GVH3-A131-1-65-2-R33  [LED-SMD_L3.0-W1.4-RD]  340.8 136.6 90 top
F2  MICROSMD035F-2  [F1210]  172.6 4.8 180 top
H3  HB-PH3-25417PB2GOP  [HDR-TH_7P-P2.54-V-M]  210.2 1.7 0 top
NOREF  -  [Pad_e300]  292.2 126.9 0 top
NOREF#2  -  [Pad_e301]  320.8 126.9 0 top
NOREF#3  -  [Pad_e299]  291.1 156.15 0 top
Q1  AO3400  [SOT-23-3_L2.9-W1.3-P1.90-LS2.4-BR]  290.9 103.6 270 top
Q2  SIRA62DP-T1-RE3  [POWERPAK-SO-8_L5.9-W4.9-P1.27-LS6.2-BL]  313.43 111.38 270 top
R1  1kΩ  [R0603]  182 24.2 0 top
R2  100kΩ  [R0603]  189.7 76.8 180 top
R3  330Ω  [R0603]  329 131.33 270 top
R4  220Ω  [R0603]  177.4 12.6 180 top
R5  220Ω  [R0603]  113.6 154.2 0 top
R6  220Ω  [R0603]  211.6 154.2 0 top
R7  220Ω  [R0603]  310 105.6 0 top
R8  330Ω  [R0603]  329.51 123.71 150 top
R9  330Ω  [R0603]  335.86 123.96 0 top
R10  330Ω  [R0603]  333.19 131.84 180 top
R11  330Ω  [R0603]  332.94 138.06 0 top
R12  330Ω  [R0603]  337.64 115.33 90 top
R13  330Ω  [R0603]  337.77 131.84 90 top
R14  330Ω  [R0603]  334.85 141.61 90 top
R15  330Ω  [R0603]  339.16 111.13 0 top
R16  330Ω  [R0603]  339.16 118.12 180 top
R17  330Ω  [R0603]  339.54 123.96 180 top
R18  330Ω  [R0603]  339.16 128.03 0 top
R19  330Ω  [R0603]  338.65 144.53 180 top
R20  330Ω  [R0603]  340.18 131.84 270 top
R21  330Ω  [R0603]  338.91 136.91 90 top
R22  330Ω  [R0603]  340.05 141.11 90 top
R23  330Ω  [R0603]  329 114.06 270 top
R24  330Ω  [R0603]  332.81 111.13 180 top
R25  330Ω  [R0603]  333.83 114.94 180 top
R26  330Ω  [R0603]  329.51 121.29 210 top
R27  330Ω  [R0603]  334.08 118.25 0 top
R28  330Ω  [R0603]  329 141.11 270 top
R29  330Ω  [R0603]  348.04 118.07 180 top
R30  330Ω  [R0603]  352.86 122.26 90 top
R31  330Ω  [R0603]  354.39 118.07 0 top
R32  330Ω  [R0603]  349.05 121.88 180 top
R33  330Ω  [R0603]  346.77 143.72 210 top
R34  330Ω  [R0603]  351.34 140.67 0 top
R35  330Ω  [R0603]  346.77 146.13 150 top
R36  330Ω  [R0603]  353.12 146.39 0 top
R37  330Ω  [R0603]  348.54 131.78 180 top
R38  330Ω  [R0603]  348.16 125.18 0 top
R39  330Ω  [R0603]  344.23 128.23 270 top
R40  330Ω  [R0603]  351.46 131.91 270 top
R41  330Ω  [R0603]  353.88 131.66 180 top
R42  330Ω  [R0603]  355.27 128.23 90 top
R43  330Ω  [R0603]  347.53 151.59 90 top
R44  330Ω  [R0603]  343.97 155.4 90 top
R45  330Ω  [R0603]  339.15 155.53 90 top
R46  330Ω  [R0603]  336.48 151.72 90 top
R47  330Ω  [R0603]  353.12 137.37 180 top
R48  330Ω  [R0603]  346.51 135.85 90 top
R51  1kΩ  [R0603]  307.3 109.3 180 top
R52  1kΩ  [R0603]  206.9 4.7 180 top
R53  100kΩ  [R0603]  290.9 100.8 0 top
R54  100kΩ  [R0603]  311.4 107.8 180 top
R57  10Ω  [R1206]  320.6 112.5 0 top
R58  10Ω  [R1206]  320.6 110 0 top
R59  1kΩ  [R0603]  286.4 101.9 90 top
R60  5.1Ω  [R1210]  306.6 112 0 top
U1  Seeeduino Xaio_SEEEDUINO-XIAO_  [COMM-SMD_SEEEDUINO-XIAO]  189.5 10.5 180 top
U2  PT19-21C/L41/TR8  [LED-SMD_L1.6-W0.8_PT19-21B]  189.7 80.1 0 top

## Footprints (pads in the part's own frame, mm; a bottom-side part is the same pattern mirrored in y, then rotated)
C0603
  rect 0.8x0.9 smd: 1(-0.7,0) 2(0.7,0)
COMM-SMD_SEEEDUINO-XIAO
  rect 2.5x1.8 smd: 1(-8.75,7.62) 2(-8.75,5.08) 3(-8.75,2.54) 4(-8.75,0) 5(-8.75,-2.54) 6(-8.75,-5.08) 7(-8.75,-7.62) 8(8.75,-7.62) 9(8.7,-5.08) 10(8.7,-2.54) 11(8.75,0) 12(8.75,2.54) 13(8.75,5.08) 14(8.75,7.62)
CONN-SMD_5P-P1.25_SM05B-GHS-TB
  rect 0.6x1.7 smd: 1(-2.5,1.6) 2(-1.25,1.6) 3(0,1.6) 4(1.25,1.6) 5(2.5,1.6)
  rect 1x2.7 smd: 6(4.35,-1.6) 7(-4.35,-1.6)
F1210
  rect 1.485x2.781 smd: 1(-1.6,0) 2(1.6,0)
HDR-TH_7P-P2.54-V-M
  rect 1.7x1.7 hole 1.1: 1(-7.62,0)
  round 1.7 hole 1.1: 2(-5.08,0) 3(-2.54,0) 4(0,0) 5(2.54,0) 6(5.08,0) 7(7.62,0)
LED-SMD_6P-L5.0-W5.0-P1.60-LS5.4_A-SC5050ARGBC-B01-03-1T
  rect 1.625x1 smd: 1(-2.31,1.61) 2(-2.288,0) 3(-2.288,-1.6) 4(2.288,-1.6) 5(2.288,0) 6(2.288,1.6)
LED-SMD_L1.6-W0.8_PT19-21B
  rect 0.8x0.8 smd: 1(-0.75,0) 2(0.75,0)
LED-SMD_L3.0-W1.4-RD
  rect 2x1 smd: 1(-1.05,0)
  rect 1.2x1 smd: 2(1.05,0)
Pad_e299
  round 2.4 hole 1.8: 1(0,0)
Pad_e300
  round 2.4 hole 1.8: 1(0,0)
Pad_e301
  round 2.4 hole 1.8: 1(0,0)
POWERPAK-SO-8_L5.9-W4.9-P1.27-LS6.2-BL
  rect 0.75x1.2 smd: 1(-1.905,-2.9) 2(-0.635,-2.9) 3(0.635,-2.9) 4(1.905,-2.9) 5(1.905,2.9) 6(0.635,2.9) 7(-0.635,2.9) 8(-1.905,2.9)
  rect 4.5x4.1 smd: 8(0,0.609)
R0603
  rect 0.806x0.864 smd: 1(-0.753,0) 2(0.753,0)
R1206
  rect 1.208x1.701 smd: 1(-1.479,0) 2(1.479,0)
R1210
  rect 1.282x2.808 smd: 1(-1.441,0) 2(1.441,0)
SOT-23-3_L2.9-W1.3-P1.90-LS2.4-BR
  rect 1.25x0.7 smd: 1(1,-0.95) 2(1,0.95) 3(-1,0)

## Nets
3V3: H3.6 R2.2 U1.12
GND: C1.2 C2.2 C3.2 C4.2 C5.2 C6.2 C7.2 C8.2 C9.2 C10.2 C11.2 C12.2 C13.2 C14.2 C15.2 C16.2 C17.2 C18.2 C19.2 C20.2 C21.2 C22.2 C23.2 C24.2 C25.2 C26.2 C27.2 C28.2 C29.2 C30.2 C31.2 C32.2 C33.2 C34.2 C35.2 C36.2 C37.2 C38.2 C39.2 C40.2 C41.2 C42.2 C43.2 C44.2 C45.2 C46.2 C47.2 C48.2 C49.2 C50.2 C51.2 C52.2 C53.2 C54.2 C55.2 C56.2 C57.2 C58.2 C59.2 C60.2 C61.2 C62.2 C63.2 C64.2 C65.2 C66.2 C67.2 C68.2 C69.2 C70.2 C71.2 C72.2 C73.2 C74.2 C75.2 C76.2 C77.2 C78.2 C79.2 C80.2 C81.2 C82.2 C83.2 C84.2 C85.2 C86.2 C87.2 C88.2 C89.2 C90.2 C91.2 C92.2 C93.2 C94.2 C95.2 C96.2 C97.2 C98.2 C99.2 C100.2 C101.2 C102.2 C103.2 C104.2 C105.2 C185.1 C186.2 C187.1 D1.6 D2.6 D3.6 D4.6 D5.6 D6.6 D7.6 D8.6 D9.6 D10.6 D11.6 D12.6 D13.6 D14.6 D15.6 D16.6 D17.6 D18.6 D19.6 D20.6 D21.6 D22.6 D23.6 D24.6 D25.6 D26.6 D27.6 D28.6 D29.6 D30.6 D31.6 D32.6 D33.6 D34.6 D35.6 D36.6 D37.6 D38.6 D39.6 D40.6 D41.6 D42.6 D43.6 D44.6 D45.6 D46.6 D47.6 D48.6 D49.6 D50.6 D51.6 D52.6 D53.6 D54.6 D55.6 D56.6 D57.6 D58.6 D59.6 D60.6 D61.6 D62.6 D63.6 D64.6 D65.6 D66.6 D67.6 D68.6 D69.6 D70.6 D71.6 D72.6 D73.6 D74.6 D75.6 D76.6 D77.6 D78.6 D79.6 D80.6 D81.6 D82.6 D83.6 D84.6 D85.6 D86.6 D87.6 D88.6 D89.6 D90.6 D91.6 D92.6 D93.6 D94.6 D95.6 D96.6 D97.6 D98.6 D99.6 D100.6 D101.6 D102.6 D103.6 D104.6 D105.6 D106.6 H3.7 Q1.2 R53.2 R54.1 R60.1 U1.13 U2.1
VCC: C1.1 C2.1 C3.1 C4.1 C5.1 C6.1 C7.1 C8.1 C9.1 C10.1 C11.1 C12.1 C13.1 C14.1 C15.1 C16.1 C17.1 C18.1 C19.1 C20.1 C21.1 C22.1 C23.1 C24.1 C25.1 C26.1 C27.1 C28.1 C29.1 C30.1 C31.1 C32.1 C33.1 C34.1 C35.1 C36.1 C37.1 C38.1 C39.1 C40.1 C41.1 C42.1 C43.1 C44.1 C45.1 C46.1 C47.1 C48.1 C49.1 C50.1 C51.1 C52.1 C53.1 C54.1 C55.1 C56.1 C57.1 C58.1 C59.1 C60.1 C61.1 C62.1 C63.1 C64.1 C65.1 C66.1 C67.1 C68.1 C69.1 C70.1 C71.1 C72.1 C73.1 C74.1 C75.1 C76.1 C77.1 C78.1 C79.1 C80.1 C81.1 C82.1 C83.1 C84.1 C85.1 C86.1 C87.1 C88.1 C89.1 C90.1 C91.1 C92.1 C93.1 C94.1 C95.1 C96.1 C97.1 C98.1 C99.1 C100.1 C101.1 C102.1 C103.1 C104.1 C105.1 C186.1 CN1.1 D1.3 D1.5 D2.3 D2.5 D3.3 D3.5 D4.3 D4.5 D5.3 D5.5 D6.3 D6.5 D7.3 D7.5 D8.3 D8.5 D9.3 D9.5 D10.3 D10.5 D11.3 D11.5 D12.3 D12.5 D13.3 D13.5 D14.3 D14.5 D15.3 D15.5 D16.3 D16.5 D17.3 D17.5 D18.3 D18.5 D19.3 D19.5 D20.3 D20.5 D21.3 D21.5 D22.3 D22.5 D23.3 D23.5 D24.3 D24.5 D25.3 D25.5 D26.3 D26.5 D27.3 D27.5 D28.3 D28.5 D29.3 D29.5 D30.3 D30.5 D31.3 D31.5 D32.3 D32.5 D33.3 D33.5 D34.3 D34.5 D35.3 D35.5 D36.3 D36.5 D37.3 D37.5 D38.3 D38.5 D39.3 D39.5 D40.3 D40.5 D41.3 D41.5 D42.3 D42.5 D43.3 D43.5 D44.3 D44.5 D45.3 D45.5 D46.3 D46.5 D47.3 D47.5 D48.3 D48.5 D49.3 D49.5 D50.3 D50.5 D51.3 D51.5 D52.3 D52.5 D53.3 D53.5 D54.3 D54.5 D55.3 D55.5 D56.3 D56.5 D57.3 D57.5 D58.3 D58.5 D59.3 D59.5 D60.3 D60.5 D61.3 D61.5 D62.3 D62.5 D63.3 D63.5 D64.3 D64.5 D65.3 D65.5 D66.3 D66.5 D67.3 D67.5 D68.3 D68.5 D69.3 D69.5 D70.3 D70.5 D71.3 D71.5 D72.3 D72.5 D73.3 D73.5 D74.3 D74.5 D75.3 D75.5 D76.3 D76.5 D77.3 D77.5 D78.3 D78.5 D79.3 D79.5 D80.3 D80.5 D81.3 D81.5 D82.3 D82.5 D83.3 D83.5 D84.3 D84.5 D85.3 D85.5 D86.3 D86.5 D87.3 D87.5 D88.3 D88.5 D89.3 D89.5 D90.3 D90.5 D91.3 D91.5 D92.3 D92.5 D93.3 D93.5 D94.3 D94.5 D95.3 D95.5 D96.3 D96.5 D97.3 D97.5 D98.3 D98.5 D99.3 D99.5 D100.3 D100.5 D101.3 D101.5 D102.3 D102.5 D103.3 D103.5 D104.3 D104.5 D105.3 D105.5 D106.3 D106.5 F2.2 H3.5 R3.1 R8.2 R9.1 R10.2 R11.2 R12.1 R13.1 R14.1 R15.1 R16.1 R17.1 R18.1 R19.1 R20.1 R21.1 R22.1 R23.1 R24.1 R25.2 R26.2 R27.1 R28.1 R29.1 R30.1 R31.1 R32.2 R33.2 R34.1 R35.2 R36.1 R37.2 R38.2 R39.1 R40.1 R41.1 R42.1 R43.1 R44.2 R45.2 R46.1 R47.1 R48.1
$1I2334\$1N1294: D27.1 D28.2
$1I2334\$1N1306: D26.1 D27.2
$1I2334\$1N1312: D25.1 D26.2
$1I2348\$1N1294: D3.1 D4.2
$1I2348\$1N1306: D2.1 D3.2
$1I2348\$1N1312: D1.1 D2.2
$1I2362\$1N1294: D23.1 D24.2
$1I2362\$1N1306: D22.1 D23.2
$1I2362\$1N1312: D21.1 D22.2
$1I2376\$1N1294: D19.1 D20.2
$1I2376\$1N1306: D18.1 D19.2
$1I2376\$1N1312: D17.1 D18.2
$1I2400\$1N1294: D11.1 D12.2
$1I2400\$1N1306: D10.1 D11.2
$1I2400\$1N1312: D9.1 D10.2
$1I2414\$1N1294: D7.1 D8.2
$1I2414\$1N1306: D6.1 D7.2
$1I2414\$1N1312: D5.1 D6.2
$1I2428\$1N1294: D15.1 D16.2
$1I2428\$1N1306: D14.1 D15.2
$1I2428\$1N1312: D13.1 D14.2
$1I2644\$1N1294: D31.1 D32.2
$1I2644\$1N1306: D30.1 D31.2
$1I2644\$1N1312: D29.1 D30.2
$1I2658\$1N1294: D55.1 D56.2
$1I2658\$1N1306: D54.1 D55.2
$1I2658\$1N1312: D53.1 D54.2
$1I2672\$1N1294: D35.1 D36.2
$1I2672\$1N1306: D34.1 D35.2
$1I2672\$1N1312: D33.1 D34.2
$1I2686\$1N1294: D51.1 D52.2
$1I2686\$1N1306: D50.1 D51.2
$1I2686\$1N1312: D49.1 D50.2
$1I2700\$1N1294: D47.1 D48.2
$1I2700\$1N1306: D46.1 D47.2
$1I2700\$1N1312: D45.1 D46.2
$1I2714\$1N1294: D39.1 D40.2
$1I2714\$1N1306: D38.1 D39.2
$1I2714\$1N1312: D37.1 D38.2
$1I2728\$1N1294: D43.1 D44.2
$1I2728\$1N1306: D42.1 D43.2
$1I2728\$1N1312: D41.1 D42.2
$1I2914\$1N1294: D67.1 D68.2
$1I2914\$1N1306: D66.1 D67.2
$1I2914\$1N1312: D65.1 D66.2
$1I2928\$1N1294: D71.1 D72.2
$1I2928\$1N1306: D70.1 D71.2
$1I2928\$1N1312: D69.1 D70.2
$1I2942\$1N1294: D63.1 D64.2
$1I2942\$1N1306: D62.1 D63.2
$1I2942\$1N1312: D61.1 D62.2
$1I2956\$1N1294: D83.1 D84.2
$1I2956\$1N1306: D82.1 D83.2
$1I2956\$1N1312: D81.1 D82.2
$1I2970\$1N1294: D75.1 D76.2
$1I2970\$1N1306: D74.1 D75.2
$1I2970\$1N1312: D73.1 D74.2
$1I2984\$1N1294: D59.1 D60.2
$1I2984\$1N1306: D58.1 D59.2
$1I2984\$1N1312: D57.1 D58.2
$1I2998\$1N1294: D79.1 D80.2
$1I2998\$1N1306: D78.1 D79.2
$1I2998\$1N1312: D77.1 D78.2
$1I3618\$1N1306: D86.1 D87.2
$1I3618\$1N1312: D85.1 D86.2
$1I3632\$1N1306: D89.1 D90.2
$1I3632\$1N1312: D88.1 D89.2
$1I3646\$1N1306: D92.1 D93.2
$1I3646\$1N1312: D91.1 D92.2
$1I3660\$1N1306: D95.1 D96.2
$1I3660\$1N1312: D94.1 D95.2
$1I3674\$1N1306: D98.1 D99.2
$1I3674\$1N1312: D97.1 D98.2
$1I3688\$1N1306: D101.1 D102.2
$1I3688\$1N1312: D100.1 D101.2
$1I3702\$1N1306: D104.1 D105.2
$1I3702\$1N1312: D103.1 D104.2
$1I10054\$1N510: D108.2 R12.2
$1I10054\$1N514: D109.2 R24.2
$1I10054\$1N518: D110.2 R15.2
$1I10054\$1N521: D107.2 R23.2
$1I10054\$1N522: D111.2 R25.1
$1I10054\$1N974: D113.2 R26.1
$1I10054\$1N981: D112.2 R16.2
$1I10054\$1N989: D114.2 R27.2
$1I10054\$1N1114: D115.2 R8.1
$1I10054\$1N1215: D116.2 R9.2
$1I10054\$1N1326: D117.2 R17.2
$1I10054\$1N1705: D119.2 R10.1
$1I10054\$1N1707: D120.2 R3.2
$1I10054\$1N1710: D118.2 R13.2
$1I10054\$1N1813: D121.2 R18.2
$1I10054\$1N1896: D122.2 R20.2
$1I10054\$1N2040: D203.2 R21.2
$1I10054\$1N2547: D124.2 R28.2
$1I10054\$1N2548: D125.2 R14.2
$1I10054\$1N2550: D123.2 R11.1
$1I10054\$1N2558: D126.2 R19.2
$1I10054\$1N2559: D127.2 R22.2
$1I10570\$1N510: D128.2 R30.2
$1I10570\$1N514: D129.2 R29.2
$1I10570\$1N518: D130.2 R31.2
$1I10570\$1N522: D131.2 R32.1
$1I10570\$1N974: D132.2 R33.1
$1I10570\$1N989: D133.2 R34.2
$1I10570\$1N1114: D134.2 R35.1
$1I10570\$1N1215: D135.2 R36.2
$1I10570\$1N1705: D136.2 R37.1
$1I10570\$1N2547: D138.2 R39.2
$1I10570\$1N2548: D139.2 R40.2
$1I10570\$1N2550: D137.2 R38.1
$1I10570\$1N2558: D140.2 R41.2
$1I10570\$1N2559: D141.2 R42.2
$1I10570\$1N16102: D142.2 R46.2
$1I10570\$1N16104: D143.2 R45.1
$1I10570\$1N16105: D144.2 R44.1
$1I10570\$1N16107: D145.2 R43.2
$1I10570\$1N16193: D146.2 R47.2
$1I10570\$1N16306: D147.2 R48.2
A1_D1: H3.1 U1.2
A6_D6: H3.2 U1.7
A7_D7: H3.3 R59.1 U1.8
A10_D10: H3.4 U1.11
DIGITS_CTRL: R4.1 U1.10
EIGHT1TO2: D28.1 R5.1
EIGHT2TO3: D56.1 R6.1
EIGHT3TO4: D84.1 R7.1
EIGHT4TODOT: D105.1 D106.2
LED_CURRENT_SENS: C187.2 R51.2 U1.4
LIGHT_CTRL: R52.2 U1.1
PHOTO_SENS: C185.2 R2.1 U1.3 U2.2
SENS_EN: R1.1 U1.9
SENS_SCL: CN1.3 U1.6
SENS_SDA: CN1.4 U1.5
SENS_TX: CN1.5 R59.2
$1N2443: D12.1 D13.2
$1N2444: D16.1 D17.2
$1N2445: D24.1 D25.2
$1N2446: D20.1 D21.2
$1N2447: D1.2 R4.2
$1N2448: D4.1 D5.2
$1N2449: D8.1 D9.2
$1N2742: D44.1 D45.2
$1N2743: D52.1 D53.2
$1N2744: D48.1 D49.2
$1N2745: D40.1 D41.2
$1N2746: D36.1 D37.2
$1N2747: D32.1 D33.2
$1N2749: D29.2 R5.2
$1N3012: D60.1 D61.2
$1N3013: D80.1 D81.2
$1N3014: D72.1 D73.2
$1N3016: D57.2 R6.2
$1N3017: D64.1 D65.2
$1N3018: D68.1 D69.2
$1N3019: D76.1 D77.2
$1N3477: F2.1 U1.14
$1N3732: D87.1 D88.2
$1N3740: D102.1 D103.2
$1N3755: D90.1 D91.2
$1N3765: D93.1 D94.2
$1N3778: D96.1 D97.2
$1N3783: D99.1 D100.2
$1N4074: D85.2 R7.2
$1N11563: D128.1 D129.1 D130.1 D131.1 D132.1 D133.1 D134.1 D135.1 D136.1 D137.1 D138.1 D139.1 D140.1 D141.1 D142.1 D143.1 D144.1 D145.1 D146.1 D147.1 R58.2
$1N11836: Q2.1 Q2.2 Q2.3 R51.1 R60.2
$1N11996: CN1.2 Q1.3
$1N12115: Q1.1 R1.2 R53.1
$1N12286: Q2.4 R52.1 R54.2
$1N14042: Q2.5 Q2.6 Q2.7 Q2.8 R57.1 R58.1
$1N14046: D107.1 D108.1 D109.1 D110.1 D111.1 D112.1 D113.1 D114.1 D115.1 D116.1 D117.1 D118.1 D119.1 D120.1 D121.1 D122.1 D123.1 D124.1 D125.1 D126.1 D127.1 D203.1 R57.2

Pads without a net: CN1 6 7; D1 4; D2 4; D3 4; D4 4; D5 4; D6 4; D7 4; D8 4; D9 4; D10 4; D11 4; D12 4; D13 4; D14 4; D15 4; D16 4; D17 4; D18 4; D19 4; D20 4; D21 4; D22 4; D23 4; D24 4; D25 4; D26 4; D27 4; D28 4; D29 4; D30 4; D31 4; D32 4; D33 4; D34 4; D35 4; D36 4; D37 4; D38 4; D39 4; D40 4; D41 4; D42 4; D43 4; D44 4; D45 4; D46 4; D47 4; D48 4; D49 4; D50 4; D51 4; D52 4; D53 4; D54 4; D55 4; D56 4; D57 4; D58 4; D59 4; D60 4; D61 4; D62 4; D63 4; D64 4; D65 4; D66 4; D67 4; D68 4; D69 4; D70 4; D71 4; D72 4; D73 4; D74 4; D75 4; D76 4; D77 4; D78 4; D79 4; D80 4; D81 4; D82 4; D83 4; D84 4; D85 4; D86 4; D87 4; D88 4; D89 4; D90 4; D91 4; D92 4; D93 4; D94 4; D95 4; D96 4; D97 4; D98 4; D99 4; D100 4; D101 4; D102 4; D103 4; D104 4; D105 4; D106 1 4; NOREF 1; NOREF#2 1; NOREF#3 1

## Via types
v1: diameter 0.61, hole 0.305, Top Layer to Bottom Layer, 295 vias
v2: diameter 0.61, hole 0.3, Top Layer to Bottom Layer, 3 vias

## Routing (per net, layer and track width the routed paths; a pad name or vN(x,y) marks a point on that pad's centre or on a via; arc(x,y) is an arc through that point)
3V3: length 115.3
  Top Layer w0.254: v1(182.3,7.5) 180.79,7.5 180.75,7.46 ; v1(214.18,5.1) 213.9,5.1 200.5,18.5 200.5,19.3 198.1,21.7 v1(184.7,21.7) 184.7,73.9 187.5,76.7 188.85,76.7 R2.2
  Bottom Layer w0.254: H3.6 215.28,4 v1(214.18,5.1) ; v1(182.3,7.5) 182.6,7.5 184.7,9.6 v1(184.7,21.7)
GND: length 318.7
  Top Layer w0.254: C187.1 v1(201.3,7.8) ; R54.1 v1(312.8,107.8) ; U2.1 v1(188.95,79.3)
  Top Layer w0.5: D69.6 259.39,11.29 v1(259.39,12.45) ; v1(63.4,12.4) D13.6 ; v1(306.6,95.54) 306.5,95.54 306.45,95.59 ; C34.2 170.27,119.36 v1(170.26,119.36) ; C95.2 323.47,12.8 v1(323.48,12.8) ; v1(12.74,25.65) 12.69,25.6 C17.2 ; C101.2 v1(306.55,80.51) ; C54.2 136.64,76.27 v1(136.64,76.26) ; C29.2 121.6,147.31 v1(121.65,147.26) ; v1(208.44,139.6) D80.6 ; C81.2 219.6,76.31 ; 219.6,76.31 219.55,76.26 v1(219.65,76.26) 219.6,76.31 ; 219.6,76.31 219.65,76.36 ; D75.6 v1(208.65,53.6) ; C53.2 121.6,76.31 121.65,76.26 v1(121.59,76.2) ; v1(110.34,68.65) 109.34,68.65 D48.6 ; v1(247.69,76.26) 247.6,76.36 D83.6 ; C77.2 208.69,96.6 208.74,96.65 v1(208.74,94.6) D77.6 ; D81.6 217.6,76.28 v1(217.58,76.26) ; D41.6 v1(161.4,12.44) ; v1(110.74,111.64) 110.73,111.64 C50.2 ; D94.6 v1(340.51,12.46) ; v1(72.26,48.36) 72.27,48.36 C10.2 ; C58.2 234.64,147.27 v1(234.64,147.26) ; D103.6 v1(313.5,51.61) ; D31.6 v1(149.6,147.56) ; v1(136.64,147.46) 136.64,147.47 C30.2 ; C25.2 23.6,76.41 v1(23.55,76.36) ; C89.2 v1(347.28,73.32) ; C82.2 234.64,76.27 v1(234.64,76.26) ; D23.6 v1(12.44,124.6) ; C103.2 315.5,51.41 v1(315.55,51.36) ; C62.2 268.27,119.36 v1(268.26,119.36) ; D14.6 48.44,11.33 v1(48.44,12.49) ; v1(170.56,91.36) 170.57,91.35 171.66,91.35 D36.6 ; C94.2 338.52,12.75 v1(338.47,12.8) ; v1(306.45,49.76) 306.45,49.76 D99.6 ; v1(72.26,63.35) 72.31,63.4 C9.2 ; v1(208.74,25.65) 208.69,25.6 C73.2 ; v1(164.65,147.46) 164.65,148.66 D32.6 ; C33.2 170.31,134.4 v1(170.26,134.35) ; v1(229.41,12.44) 229.4,12.43 D71.6 ; v1(149.59,76.36) 149.6,76.37 D55.6 ; v1(12.54,139.55) 11.34,139.55 D24.6 ; 269.66,91.35 D64.6 ; 269.66,91.35 269.71,91.3 269.71,90.66 ; 269.66,91.35 269.71,90.66 ; v1(38.64,76.46) 38.64,76.47 C26.2 ; 23.65,147.26 23.6,147.31 C1.2 ; 23.65,147.26 21.95,147.26 ; 23.65,147.26 38.64,147.26 ; D102.6 v1(306.36,93.47) ; C57.2 219.6,147.41 v1(219.55,147.36) ; D60.6 262.55,148.66 v1(262.55,147.56) ; v1(72.26,106.31) 72.36,106.4 D7.6 ; v1(72.26,106.31) 72.26,119.36 ; v1(72.26,106.31) v1(72.26,104.28) v1(72.26,91.35) 73.66,91.35 D8.6 ; 269.71,90.66 269.69,90.63 v1(269.76,90.56) ; C38.2 v1(170.27,48.36) ; C49.2 v1(110.69,96.6) 110.74,96.65 110.74,94.95 110.39,94.6 D49.6 ; D46.6 109.31,38.58 v1(110.41,38.58) ; 38.64,147.26 38.64,147.27 C2.2 ; 38.64,147.26 v1(51.59,147.26) 51.6,147.27 D3.6 ; C42.2 144.36,12.53 v1(144.36,12.54) ; D25.6 v1(21.6,76.56) ; D52.6 110.69,139.6 v1(110.74,139.55) ; D84.6 262.65,77.76 v1(263.45,77.76) ; C65.2 269.03,63.35 v1(268.45,63.35) ; C74.2 208.53,40.64 v1(208.54,40.64) ; v1(170.46,35.41) 170.47,35.4 D39.6 ; v1(188.95,79.3) 188.95,78.35 C185.1 ; 72.26,119.36 72.27,119.36 C6.2 ; 72.26,119.36 v1(72.26,121.39) 72.26,134.35 72.31,134.4 C5.2 ; D43.6 131.4,12.43 v1(131.41,12.44) ; v1(347.31,14.47) C93.2 ; D20.6 12.39,68.6 v1(12.44,68.65) ; v1(330.65,97.33) 330.66,97.33 330.66,98.01 ; v1(310.52,12.5) 310.51,12.5 D96.6 ; D79.6 208.43,124.6 v1(208.44,124.59) ; C22.2 12.53,111.64 v1(12.54,111.64) ; D57.6 v1(217.6,147.56) ; D35.6 170.47,106.4 v1(170.46,106.41) ; C104.2 330.54,51.48 v1(330.53,51.47) ; D105.6 343.5,51.57 v1(343.49,51.56) ; v1(306.75,65.51) 306.7,65.46 C100.2 ; v1(66.6,76.66) D28.6 ; v1(159.35,12.64) 159.4,12.59 C41.2 ; D11.6 72.57,35.4 v1(72.56,35.41) ; v1(247.59,147.56) 247.6,147.57 D59.6 ; D29.6 v1(119.6,147.46) ; C37.2 170.31,63.4 v1(170.26,63.35) ; D12.6 73.66,20.35 v1(72.5,20.35) ; v1(306.75,21.81) 306.7,21.76 C97.2 ; v1(110.74,25.65) 110.69,25.6 C45.2 ; v1(268.56,106.41) 268.57,106.4 D63.6 ; D15.6 v1(33.4,12.64) ; 348.63,60.36 v1(347.57,60.36) ; 180.75,4.92 v1(179,4.92) ; D73.6 v1(208.59,23.6) ; v1(306.75,36.8) 306.75,36.81 C98.2 ; v1(242.36,12.54) 242.36,12.53 C70.2 ; v1(110.71,40.61) 110.67,40.64 C46.2 ; D91.6 v1(347.52,46.56) ; v1(164.6,76.26) D56.6 ; D1.6 21.6,147.39 ; D17.6 v1(12.44,23.6) ; v1(46.36,12.74) 46.36,12.73 C14.2 ; C21.2 v1(12.69,96.6) ; D33.6 v1(170.56,136.4) ; v1(61.45,12.64) 61.4,12.59 C13.2 ; D51.6 110.43,124.6 v1(110.44,124.59) ; D37.6 v1(170.61,65.4) ; v1(170.56,20.45) 171.66,20.45 D40.6 ; D27.6 51.6,76.57 v1(51.59,76.56) ; D21.6 v1(12.54,94.6) ; D9.6 v1(72.61,65.4) ; D53.6 v1(119.6,76.5) ; R53.2 v1(291.65,101.5) ; C78.2 v1(208.53,111.64) ; D72.6 214.35,11.34 v1(214.35,12.74) ; 66.6,147.72 66.65,147.77 66.65,148.66 ; D16.6 18.45,11.34 v1(18.45,12.34) ; v1(116.4,12.43) D44.6 ; D45.6 v1(110.74,23.6) ; D97.6 v1(306.41,19.76)
  Top Layer w0.508: v1(257.23,147.26) 257.19,147.31 C60.2 ; C99.2 306.52,51.86 v1(306.55,51.89) ; v1(12.43,53.69) 11.37,53.69 D19.6 ; D68.6 269.67,20.36 v1(268.55,20.36) ; C90.2 v1(347.3,58.27) ; v1(110.64,63.23) 110.59,63.19 C48.2 ; v1(72.56,50.39) 72.57,50.4 D10.6 ; v1(72.61,136.39) 72.61,136.4 D5.6 ; v1(268.35,25.77) 269.05,25.77 C68.2 ; v1(347.36,44.6) 347.39,44.57 C91.2 ; C61.2 269.04,134.35 v1(268.26,134.35) ; v1(328.62,97.43) 328.62,97.43 D86.6 ; v1(347.56,31.64) 348.56,31.64 D92.6 ; D30.6 134.6,147.57 v1(134.61,147.56) ; C4.2 61.19,147.41 v1(61.23,147.36) ; C51.2 110.51,126.7 v1(110.54,126.72) ; C79.2 208.71,126.7 v1(208.74,126.72) ; C20.2 12.69,63.19 v1(12.74,63.23) ; v1(268.59,65.4) 269.71,65.4 D65.6 ; C55.2 151.7,76.29 v1(151.72,76.26) ; v1(219.77,12.74) 219.81,12.69 C72.2 ; v1(129.38,12.64) 129.3,12.57 C43.2 ; 72.26,96.77 72.31,96.81 C8.2 ; v1(12.73,40.63) 11.87,40.63 C18.2 ; v1(36.61,76.56) 36.6,76.57 D26.6 ; D76.6 208.35,68.6 v1(208.39,68.56) ; C27.2 53.7,76.29 v1(53.73,76.26) ; D66.6 268.66,50.4 v1(268.65,50.39) ; C96.2 308.42,12.78 v1(308.39,12.8) ; D54.6 134.6,76.27 v1(134.61,76.26) ; v1(257.23,76.26) 257.19,76.31 C84.2 ; v1(12.74,126.72) 12.71,126.7 C23.2 ; v1(31.27,12.74) 31.3,12.71 C15.2 ; C40.2 170.31,25.81 v1(170.26,25.77) ; v1(268.25,48.36) 269.14,48.36 C66.2 ; C36.2 170.31,96.81 v1(170.26,96.77) ; C105.2 345.6,51.49 v1(345.62,51.46) ; C80.2 v1(208.69,134.19) ; C28.2 61.19,76.31 v1(61.23,76.26) ; v1(268.25,33.27) 269.05,33.27 C67.2 ; C63.2 268.39,104.3 v1(268.36,104.28) ; v1(12.73,55.72) 12.71,55.7 C19.2 ; v1(347.5,90.4) 348.59,90.4 348.63,90.36 ; v1(347.48,75.36) 347.48,75.36 348.63,75.36 ; C85.2 v1(315.61,97.2) ; v1(66.6,147.6) D4.6 ; v1(110.74,109.61) 110.73,109.6 D50.6 ; v1(249.72,76.26) 249.7,76.29 C83.2 ; v1(208.74,63.23) 208.69,63.19 C76.2 ; C186.2 v1(293.89,12.1) ; v1(244.39,12.34) 244.4,12.33 D70.6 ; v1(268.56,121.39) 268.57,121.4 D62.6 ; D101.6 306.45,78.47 v1(306.45,78.47) ; D87.6 343.62,97.42 v1(343.6,97.4) ; v1(23.74,12.77) 23.74,11.99 C16.2 ; v1(347.3,88.4) 347.97,88.4 C88.2 ; v1(208.74,55.72) 208.71,55.7 C75.2 ; 21.6,147.39 21.69,147.3 ; 21.69,147.3 21.73,147.26 21.95,147.26 ; 21.69,147.3 12.2,147.3 11.29,146.39 D24.6 ; v1(170.26,50.39) 170.27,50.4 D38.6 ; C35.2 v1(170.29,104.3) ; v1(72.26,121.39) 72.27,121.4 D6.6 ; D2.6 36.6,147.27 36.61,147.26 ; C11.2 73.06,33.28 v1(72.26,33.28) ; D93.6 348.61,16.55 v1(347.46,16.55) ; C47.2 v1(110.71,55.7) ; D78.6 208.43,109.6 v1(208.44,109.61) ; D67.6 269.71,35.4 v1(268.35,35.4) ; v1(72.26,104.28) 72.29,104.3 C7.2 ; C3.2 53.7,147.29 v1(53.73,147.26) ; C56.2 v1(159.19,76.31) ; v1(325.51,12.8) 325.51,12.8 D95.6 ; D22.6 v1(12.73,109.6) ; D106.6 v1(291,13.7) ; v1(306.55,34.77) 306.55,34.76 D98.6 ; v1(303.5,112) v1(304.12,112) R60.1 ; D18.6 v1(12.73,38.6) ; D85.6 v1(313.62,97.2) ; v1(12.74,134.23) 12.69,134.19 C24.2 ; C44.2 v1(121.81,12.69) ; C12.2 72.39,25.81 v1(72.36,25.77) ; C59.2 249.7,147.29 v1(249.72,147.26) ; C71.2 227.3,12.61 v1(227.28,12.64) ; v1(159.13,147.26) 159.19,147.32 C32.2 ; D42.6 v1(146.4,12.43) ; D104.6 v1(328.5,51.57) ; D34.6 170.57,121.4 v1(170.56,121.39) ; v1(232.61,76.26) 232.6,76.27 D82.6 ; C39.2 v1(170.29,33.3) ; v1(110.74,134.23) 110.69,134.19 C52.2 ; C87.2 v1(345.71,97.26) ; D58.6 v1(232.6,147.57) ; v1(291.65,101.5) 291.85,101.7 Q1.2 ; v1(268.26,96.77) 268.31,96.81 C64.2 ; v1(347.37,29.52) C92.2 ; C69.2 257.4,12.69 v1(257.35,12.75) ; v1(306.5,63.3) 306.33,63.47 D100.6 ; v1(208.34,38.61) 208.33,38.6 D74.6 ; C102.2 306.58,95.56 v1(306.6,95.54) ; v1(268.56,136.4) D61.6 ; v1(151.72,147.36) 151.7,147.39 C31.2
  Top Layer w1: D47.6 110.58,53.6 v1(110.61,53.56)
  vias: v1(72.27,134.35)
VCC: length 2667.1
  Top Layer w0.254: 354.31,132.64 354.31,132.61 v1(354.2,132.5) ; 354.31,132.64 354.63,132.32 R41.1 ; 354.31,132.64 353.37,133.57 ; C61.1 270.52,134.36 ; R10.2 v1(331.7,131.84) ; v1(333.3,110.3) 333.57,110.57 R24.1 334.31,111.88 337.67,111.88 R15.1 338.6,110.94 v1(338.6,110.2) ; R14.1 334.54,140.86 v1(334,141.4) 331.8,143.6 329.6,143.6 329,143 R28.1 ; R38.2 354.2,125.18 354.67,124.71 355.27,124.71 ; R12.1 338.47,114.57 339.92,116.02 R16.1 ; v1(338.6,103.2) 340.37,103.2 340.42,103.15 ; v1(333.3,117.4) 333.33,117.43 R27.1 331.53,118.25 R26.2 328.86,121.44 328.3,122 328.3,122.75 ; 328.3,122.75 328.3,123.53 R8.2 ; 328.3,122.75 328.46,122.75 v1(328.5,122.8) ; 353.69,121.8 353.69,121.89 ; 353.69,121.8 v1(353.6,121.8) 353.69,121.89 ; 353.69,121.8 353.78,121.8 ; 353.69,121.8 353.69,121.8 353.74,121.75 ; 353.69,121.89 353.78,121.8 ; C45.1 108.47,25.64 ; 355.27,124.71 355.27,123.19 353.79,121.7 353.74,121.75 ; 355.27,124.71 R42.1 355.2,127.4 v1(354.5,127.4) ; C77.1 206.47,96.64 ; v1(329.1,115.6) 329.1,114.91 R23.1 ; C100.1 304.49,65.5 ; C21.1 10.48,96.64 ; R17.1 340.3,123.1 339.8,122.6 v1(338.4,122.6) 335.5,122.6 335.11,122.99 R9.1 ; 339.23,140.35 R22.1 ; 339.23,140.35 338.65,140.35 336.36,138.06 R11.2 ; 339.23,140.35 v1(339.23,140.7) ; v1(333.3,114.2) 333.3,114.72 R25.2 ; v1(338.4,127.3) 338.4,128.02 R18.1 ; 353.78,121.8 353.74,121.75 ; 353.74,121.75 353.49,121.5 R30.1 ; R46.1 336.43,151.02 335.58,151.02 335.4,151.2 335.4,153.4 338.29,156.28 R45.2 339.27,156.16 R44.2 344.01,156.2 345.6,156.2 348.6,153.2 348.6,151.8 347.64,150.84 R43.1 347.53,147.93 346.11,146.51 R35.2 346.11,146.41 345.7,146 345.7,143.76 R33.2 348.17,141.29 349.97,141.29 R34.1 350.58,139.92 351.4,139.1 352.6,139.1 353.87,137.83 ; C186.1 D106.5 ; R37.2 348.67,132.66 R40.1 352.46,132.66 353.37,133.57 ; R37.2 347.79,133.81 R48.1 ; R37.2 345.78,131.78 v1(344.3,130.3) 344.3,129.05 R39.1 ; R31.1 352.89,118.81 350.92,118.81 ; v1(338.2,136) 338.75,136 R21.1 ; 353.37,133.57 353.87,134.07 353.87,137.83 ; R32.2 347.08,121.88 346,120.8 346,117.1 346.3,116.8 348.2,116.8 348.79,117.39 348.79,118.07 349.53,118.81 350.92,118.81 ; C65.1 270.52,63.36 ; C97.1 304.49,21.8 ; C9.1 74.53,63.36 ; C25.1 23.64,78.53 ; R36.1 352.36,146.24 352.79,145.81 352.79,145.46 354.43,143.82 354.43,138.09 354.17,137.83 353.87,137.83 ; 350.92,118.81 350.93,118.8 v1(351,118.8) ; C41.1 159.36,10.47 ; C17.1 10.48,25.64 ; C91.1 349.44,44.53 ; 218.74,9.69 218.7,9.65 v1(218.7,9.1) ; v1(338.4,130.98) 337.87,130.98 R13.1 ; C49.1 108.47,96.64 ; C88.1 349.44,88.33 ; C85.1 315.65,99.39 ; R3.1 329,132.9 330.3,134.2 v1(339.5,134.2) ; C53.1 121.64,78.53 ; v1(339.23,145.2) 339.23,144.72 R19.1 ; C73.1 206.47,25.64 ; C33.1 172.53,134.36 ; C94.1 338.48,10.54 ; C1.1 23.64,149.53 ; R20.1 v1(339.5,132.59) ; C57.1 219.64,149.53 ; C37.1 172.53,63.36 ; C5.1 74.53,134.36 ; C69.1 257.36,10.47 ; C103.1 315.54,53.53 ; C29.1 121.64,149.53 ; C81.1 219.64,78.53 ; C13.1 61.36,10.47
  Top Layer w0.5: 38.62,150.31 38.62,149.56 C2.1 ; C54.1 136.62,78.56 136.62,79.31 ; D30.3 131.4,150.33 131.42,150.31 ; 271.31,23.54 271.37,23.6 D68.3 ; C18.1 10.44,40.62 9.69,40.62 ; 75.31,38.57 75.34,38.6 D11.3 ; D42.3 149.6,9.67 149.58,9.69 ; 205.69,106.42 205.67,106.4 D78.3 ; D12.3 75.37,23.6 75.31,23.54 ; D83.3 244.4,79.34 244.43,79.31 ; D43.3 134.6,9.66 134.57,9.69 ; 9.69,50.43 9.66,50.4 D19.3 ; 303.71,46.6 303.68,46.56 D99.3 ; 46.38,9.69 46.38,10.44 C14.1 ; D59.3 244.4,150.34 244.43,150.31 ; 229.42,79.31 229.4,79.33 D82.3 ; C58.1 234.62,149.56 234.62,150.31 ; D25.3 18.31,82.2 17.2,82.2 12.8,86.6 12.8,92.8 12.6,93 D21.5 ; 259.46,150.31 259.4,150.37 D60.3 ; D48.3 107.63,65.4 107.69,65.46 ; D81.3 214.4,87.2 208.6,93 D77.5 ; 161.46,79.31 161.4,79.37 D56.3 ; D38.3 173.33,53.6 173.31,53.58 ; 173.31,94.54 173.37,94.6 D36.3 ; C6.1 74.56,119.38 75.31,119.38 ; 259.46,79.31 259.4,79.37 D84.3 ; 350.22,29.54 349.48,29.54 C92.1 ; 232.57,9.69 232.6,9.66 D71.3 ; D35.3 173.34,109.6 173.31,109.57 ; D34.3 173.33,124.6 173.31,124.58 ; D96.3 313.71,9.73 313.68,9.76 ; D92.3 350.25,34.76 350.22,34.74 ; 315.65,99.39 315.65,100.17 ; D72.3 217.6,9.63 217.54,9.69 ; 303.71,31.59 303.68,31.56 D98.3 ; 48.43,150.31 48.4,150.34 D3.3 ; 270.52,134.36 271.31,134.36 ; 206.47,25.64 205.69,25.64 ; D26.3 33.4,79.33 33.42,79.31 ; D55.3 146.4,79.34 146.43,79.31 ; D32.3 161.4,150.37 161.46,150.31 ; D18.3 9.67,35.4 9.69,35.42 ; 350.22,19.73 350.25,19.76 D93.3 ; D80.3 205.63,136.4 205.69,136.46 ; C74.1 206.44,40.62 205.69,40.62 ; 61.36,10.47 61.36,9.69 ; 9.69,111.62 10.44,111.62 C22.1 ; 107.69,50.43 107.66,50.4 D47.3 ; 219.64,78.53 219.64,79.31 ; D14.3 51.6,9.67 51.58,9.69 ; 205.69,111.62 206.44,111.62 C78.1 ; D39.3 173.34,38.6 173.31,38.57 ; D22.3 9.67,106.4 9.69,106.42 ; D24.3 9.63,136.4 9.69,136.46 ; 146.43,150.31 146.4,150.34 D31.3 ; C30.1 136.62,149.56 136.62,150.31 ; D27.3 48.4,79.34 48.43,79.31 ; 119.54,9.69 119.6,9.63 D44.3 ; 219.64,149.53 219.64,150.31 ; 23.64,78.53 23.64,79.31 ; D8.3 75.37,94.6 75.31,94.54 ; D66.3 271.33,53.6 271.31,53.58 ; 131.42,79.31 131.4,79.33 D54.3 ; 63.46,150.31 63.4,150.37 D4.3 ; 247.58,9.69 247.6,9.67 D70.3 ; 38.62,79.31 38.62,78.56 C26.1 ; 303.71,36.79 304.45,36.79 C98.1 ; D74.3 205.67,35.4 205.69,35.42 ; D105.3 340.3,54.34 340.33,54.31 ; 271.31,109.57 271.34,109.6 D63.3 ; 315.54,53.53 315.54,54.31 ; D16.3 21.6,9.63 21.54,9.69 ; C101.1 304.45,80.49 303.71,80.49 ; 349.44,88.33 350.22,88.33 ; 257.36,10.47 257.36,9.69 ; 328.69,9.76 328.71,9.73 D95.3 ; 121.64,149.53 121.64,150.31 ; C38.1 172.56,48.38 173.31,48.38 ; D15.3 36.6,9.66 36.57,9.69 ; D51.3 107.66,121.4 107.69,121.43 ; C62.1 270.56,119.38 271.31,119.38 ; C95.1 323.49,10.5 323.49,9.76 ; 325.44,100.17 325.42,100.2 325.42,103.15 ; D101.3 303.68,75.27 303.71,75.29 ; 205.69,121.43 205.66,121.4 D79.3 ; D102.3 303.68,90.27 303.71,90.3 ; D62.3 271.33,124.6 271.31,124.58 ; D58.3 229.4,150.33 229.42,150.31 ; 107.69,136.46 107.63,136.4 D52.3 ; 108.47,96.64 107.69,96.64 ; 350.22,63.53 350.25,63.56 D90.3 ; C42.1 144.38,10.44 144.38,9.69 ; 107.69,111.62 108.44,111.62 C50.1 ; 206.47,96.64 205.69,96.64 ; 330.52,54.31 330.52,53.56 C104.1 ; 10.48,96.64 9.69,96.64 ; C66.1 270.56,48.38 271.31,48.38 ; 340.45,100.17 340.42,100.2 340.42,103.15 ; 271.31,38.57 271.34,38.6 D67.3 ; 205.69,65.46 205.63,65.4 D76.3 ; 107.69,40.62 108.44,40.62 C46.1 ; 173.31,119.38 172.56,119.38 C34.1 ; C86.1 330.64,99.43 330.64,100.17 ; 63.46,79.31 63.4,79.37 D28.3 ; 33.42,150.31 33.4,150.33 D2.3 ; 350.22,73.34 349.48,73.34 C89.1 ; C10.1 74.56,48.38 75.31,48.38 ; 349.44,44.53 350.22,44.53 ; 74.53,63.36 75.31,63.36 ; 107.69,106.42 107.67,106.4 D50.3 ; 172.53,134.36 173.31,134.36 ; 242.38,9.69 242.38,10.44 C70.1 ; D40.3 173.37,23.6 173.31,23.54 ; D75.3 205.66,50.4 205.69,50.43 ; D7.3 75.34,109.6 75.31,109.57 ; 304.49,65.5 303.71,65.5 ; 172.53,63.36 173.31,63.36 ; v1(169.4,6.7) 169.4,5.4 169.9,4.9 170.85,4.9 ; 107.69,35.42 107.67,35.4 D46.3 ; D89.3 350.25,78.56 350.22,78.54 ; 75.31,53.58 75.33,53.6 D10.3 ; D20.3 9.63,65.4 9.69,65.46 ; 325.32,54.31 325.3,54.33 D104.3 ; 23.64,149.53 23.64,150.31 ; 234.62,79.31 234.62,78.56 C82.1 ; 9.69,121.43 9.66,121.4 D23.3 ; 304.49,21.8 303.71,21.8 ; 75.31,124.58 75.33,124.6 D6.3 ; 74.53,134.36 75.31,134.36 ; 270.52,63.36 271.31,63.36 ; 271.31,94.54 271.37,94.6 D64.3 ; 121.64,78.53 121.64,79.31 ; 159.36,10.47 159.36,9.69 ; 10.48,25.64 9.69,25.64 ; 108.47,25.64 107.69,25.64 ; 338.48,10.54 338.48,9.76
  Top Layer w0.508: 312.01,100.17 342.01,100.17 ; 312.01,100.17 310.42,100.17 ; 312.01,100.17 D85.5 ; 205.69,93 205.69,123 ; 205.69,93 205.69,91.4 D77.3 ; 205.69,93 D77.5 ; 303.71,91.86 D102.5 ; 303.71,91.86 303.71,95.55 ; 303.71,91.86 303.71,61.86 ; D68.5 269.84,22.13 271.31,22.13 271.31,23.54 ; 35,9.69 D15.5 ; 35,9.69 65,9.69 ; 35,9.69 31.32,9.69 ; 75.31,22.13 75.31,25.79 ; 75.31,22.13 75.31,17.41 67.59,9.69 66.6,9.69 ; 75.31,22.13 73.84,22.13 D12.5 ; 53.69,79.31 53.7,79.3 C27.1 ; 53.69,79.31 61.21,79.31 ; 53.69,79.31 50,79.31 ; 75.31,138 D5.5 ; 75.31,138 75.31,139.6 ; 75.31,138 75.31,108 ; D58.5 230.9,148.81 230.9,149.95 ; 262.6,9.69 263.09,9.69 271.45,18.05 271.45,23.68 271.31,23.82 271.31,25.79 ; 262.6,9.69 D69.3 ; 262.6,9.69 261,9.69 ; D17.3 9.69,20.4 9.69,22 ; C64.1 271.28,96.81 271.31,96.79 ; 205.69,22 205.69,20.4 ; 205.69,22 D73.5 ; 205.69,22 v1(205.69,28.08) 205.69,52 ; 205.69,20.4 D73.3 ; 205.69,20.4 205.69,16.81 212.81,9.69 216.13,9.69 ; C16.1 23.81,9.72 23.79,9.69 ; 107.69,55.69 107.69,52 ; 107.69,55.69 107.69,63.21 ; 107.69,55.69 107.7,55.7 C47.1 ; 107.69,52 D47.5 ; 107.69,52 107.69,22 ; 159.21,79.31 162.87,79.31 162.87,77.84 D56.5 ; 159.21,79.31 151.69,79.31 ; 159.21,79.31 159.19,79.28 C56.1 ; 107.69,63.21 107.69,66.51 108.05,66.87 109.16,66.87 D48.5 ; 107.69,63.21 107.72,63.19 C48.1 ; D86.5 326.92,98.68 326.92,99.81 ; 9.69,137.51 9.69,146.6 13.4,150.31 20,150.31 ; 9.69,137.51 10.05,137.87 11.16,137.87 D24.5 ; 9.69,137.51 9.69,134.21 ; 249.69,79.31 249.7,79.3 C83.1 ; 249.69,79.31 257.21,79.31 ; 249.69,79.31 246,79.31 ; D22.5 11.19,107.9 10.05,107.9 ; 116.4,150.31 118,150.31 ; 116.4,150.31 D29.3 ; 116.4,150.31 115.81,150.31 107.69,142.19 107.69,137.51 ; 118,150.31 D29.5 ; 118,150.31 148,150.31 ; 312.12,9.76 342.12,9.76 ; 312.12,9.76 D96.5 ; 312.12,9.76 308.43,9.76 ; 20.49,9.69 20.13,10.05 20.13,11.16 D16.5 ; 20.49,9.69 13.91,9.69 9.7,13.9 9.7,22 ; 20.49,9.69 23.79,9.69 ; 61.21,150.31 64.51,150.31 ; 61.21,150.31 61.19,150.28 C4.1 ; 61.21,150.31 53.69,150.31 ; 173.31,37 D39.5 ; 173.31,37 173.31,67 ; 173.31,37 173.31,33.31 ; 271.31,67 271.31,37 ; 271.31,67 271.31,68.8 ; 271.31,67 D65.5 ; 75.31,25.79 75.31,33.31 ; 75.31,25.79 75.28,25.81 C12.1 ; 75.31,33.31 75.31,37 ; 75.31,33.31 75.3,33.3 C11.1 ; 310.42,100.17 310.42,103.15 ; 310.42,100.17 307.07,100.17 303.71,96.81 303.71,95.55 ; 205.69,123 D79.5 ; 205.69,123 205.69,126.69 ; 107.69,93 D49.5 110.5,93 110.7,92.8 110.7,84.9 114.69,80.91 116.4,80.91 ; 107.69,93 107.69,123 ; 107.69,93 106.09,91.4 D49.3 ; 173.31,17.6 173.31,17.51 ; 173.31,17.6 v1(173.4,17.61) ; 173.31,17.6 173.31,22.49 ; 271.31,96.79 271.31,104.31 ; 271.31,96.79 271.31,93.13 ; 271.31,104.31 271.3,104.3 C63.1 ; 271.31,104.31 271.31,108 ; 23.79,9.69 31.32,9.69 ; 350.22,18.16 D93.5 ; 350.22,18.16 350.22,14.48 350.21,14.47 ; 350.22,18.16 350.22,48.16 ; C23.1 9.7,126.7 9.69,126.69 ; C60.1 257.19,150.28 257.21,150.31 ; 133,9.69 163,9.69 ; 133,9.69 129.31,9.69 ; 133,9.69 D43.5 ; v1(104.71,19.3) D45.3 107.69,20.4 ; 173.31,67 D37.5 ; 173.31,67 173.31,68.6 ; D30.5 132.9,148.81 132.9,149.95 ; 350.22,48.16 350.22,49.76 ; 350.22,48.16 D91.5 ; 9.69,63.21 9.72,63.19 C20.1 ; 9.69,63.21 9.69,55.69 ; 9.69,63.21 9.69,66.51 10.05,66.87 11.16,66.87 D20.5 ; 271.31,33.31 271.3,33.3 C67.1 ; 271.31,33.31 271.31,37 ; 271.31,33.31 271.31,25.79 ; D36.5 171.84,93.13 173.31,93.13 ; C51.1 107.7,126.7 107.69,126.69 ; 257.21,79.31 260.51,79.31 260.87,78.95 260.87,77.84 D84.5 ; 257.21,79.31 257.19,79.28 C84.1 ; 64.51,150.31 68.39,150.31 75.31,143.39 75.31,139.6 ; 64.51,150.31 64.87,149.95 64.87,148.84 D4.5 ; 271.31,37 D67.5 ; 271.31,93.13 271.31,68.8 ; 271.31,93.13 269.84,93.13 D64.5 ; 271.31,68.8 271.51,68.6 D65.3 ; 257.21,150.31 260.81,150.31 ; 257.21,150.31 249.69,150.31 ; 159.21,150.31 162.87,150.31 ; 159.21,150.31 151.69,150.31 ; 159.21,150.31 159.19,150.28 C32.1 ; 121.79,9.69 121.81,9.72 C44.1 ; 121.79,9.69 118.13,9.69 ; 121.79,9.69 129.31,9.69 ; C99.1 303.72,51.86 303.71,51.85 303.71,48.16 ; D57.3 214.4,150.4 ; 214.4,150.4 215.91,150.4 216,150.31 ; 214.4,150.4 213.4,150.4 205.7,142.7 205.7,137.88 205.69,137.87 ; 350.22,58.28 350.21,58.27 C90.1 ; 350.22,58.28 350.22,61.97 ; 350.22,58.28 350.22,49.76 ; 151.69,79.31 148,79.31 ; 151.69,79.31 151.7,79.3 C55.1 ; 148,79.31 D55.5 ; 148,79.31 118,79.31 ; 107.69,134.21 107.72,134.19 C52.1 ; 107.69,134.21 107.69,126.69 ; 107.69,134.21 107.69,137.51 ; 216.13,9.69 216.13,11.16 D72.5 ; 216.13,9.69 219.79,9.69 ; 216,79.31 214.4,80.91 D81.3 ; 216,79.31 D81.5 ; 216,79.31 246,79.31 ; D89.5 348.73,77.06 349.87,77.06 ; 75.31,93.13 73.84,93.13 D8.5 ; 75.31,93.13 75.31,67 ; 75.31,93.13 75.31,96.79 ; 205.69,134.21 205.69,126.69 ; 205.69,134.21 205.69,137.87 ; 205.69,134.21 205.72,134.19 C80.1 ; 205.69,126.69 205.7,126.7 C79.1 ; 75.31,104.31 75.31,108 ; 75.31,104.31 75.31,96.79 ; 75.31,104.31 75.3,104.3 C7.1 ; 75.31,108 D7.5 ; 75.31,139.6 D5.3 ; 350.21,14.47 C93.1 ; 350.21,14.47 350.21,12.61 347.3,9.7 343.71,9.7 ; 246,79.31 D83.5 ; D2.5 34.9,148.81 34.9,149.95 ; 151.69,150.31 151.7,150.3 C31.1 ; 151.69,150.31 148,150.31 ; 231,9.69 261,9.69 ; 231,9.69 227.32,9.69 ; 231,9.69 D71.5 ; 173.31,96.79 173.28,96.81 C36.1 ; 173.31,96.79 173.31,93.13 ; 173.31,96.79 173.31,104.31 ; 116.4,80.91 D53.3 ; 116.4,80.91 118,79.31 ; 341.9,54.31 D105.5 ; 341.9,54.31 311.9,54.31 ; 341.9,54.31 345.58,54.31 345.6,54.3 C105.1 ; 65,9.69 D13.5 ; 65,9.69 66.6,9.69 ; 173.31,22.49 172.95,22.13 171.84,22.13 D40.5 ; 173.31,22.49 173.31,25.79 ; D52.5 109.16,137.87 108.05,137.87 107.69,137.51 ; 350.22,93.56 350.22,97.28 347.33,100.17 345.7,100.17 ; 350.22,93.56 D88.3 ; 350.22,93.56 350.22,91.97 ; 75.31,67 75.31,37 ; 75.31,67 D9.5 ; 75.31,67 76.91,68.6 D9.3 ; D38.5 171.81,52.1 172.95,52.1 ; 216,150.31 246,150.31 ; 216,150.31 D57.5 ; 107.69,20.4 107.69,15.51 113.51,9.69 118.13,9.69 ; 107.69,20.4 107.69,22 ; 74.95,52.1 73.81,52.1 D10.5 ; 173.31,68.6 D37.3 ; 173.31,68.6 173.31,93.13 ; 173.31,108 173.31,138 ; 173.31,108 D35.5 ; 173.31,108 173.31,104.31 ; 271.31,25.79 271.28,25.81 C68.1 ; 9.69,22 9.7,22 ; 9.69,22 9.69,52 ; 9.7,22 D17.5 ; 343.71,9.7 342.17,9.7 342.12,9.76 ; 343.71,9.7 D94.3 ; D28.5 64.87,77.84 64.87,78.95 64.51,79.31 61.21,79.31 ; 173.31,25.79 173.28,25.81 C40.1 ; 173.31,25.79 173.31,33.31 ; CN1.1 292.2,105.4 293,104.6 293,99.3 291.27,97.57 287.97,97.57 v1(286.1,95.7) ; 260.81,150.31 260.81,148.9 D60.5 ; 260.81,150.31 263.69,150.31 271.3,142.7 271.3,138.01 271.31,138 ; 205.69,66.51 205.69,66.51 ; 205.69,66.51 205.69,63.21 ; 205.69,66.51 205.69,66.87 207.16,66.87 D76.5 ; 303.71,95.55 303.72,95.56 C102.1 ; 107.69,126.69 107.69,123 ; 311.9,54.31 D103.5 ; 311.9,54.31 310.3,55.91 D103.3 310.3,58.4 306.83,61.86 D100.5 303.71,61.86 ; 162.87,150.31 165.59,150.31 173.31,142.59 173.31,139.6 ; 162.87,150.31 162.97,150.21 162.97,148.84 163,148.81 D32.5 ; 270.95,123.1 269.81,123.1 D62.5 ; 173.31,139.6 173.31,138 ; 173.31,139.6 D33.3 ; 173.31,138 D33.5 ; 66.6,9.69 D13.3 ; 148.1,10.05 148.1,11.19 D42.5 ; 148,150.31 D31.5 ; 173.31,33.31 173.3,33.3 C39.1 ; 249.69,150.31 246,150.31 ; 249.69,150.31 249.7,150.3 C59.1 ; 246,150.31 D59.5 ; D1.3 18.4,150.31 ; 304.06,76.77 305.2,76.77 D101.5 ; 163,9.69 D41.5 ; 163,9.69 163.01,9.7 164.6,9.7 D41.3 ; 75.31,37 D11.5 ; 108.05,107.9 109.19,107.9 D50.5 ; 271.31,108 271.31,138 ; 271.31,108 D63.5 ; D106.5 288.3,12.1 286.7,10.5 D106.3 284.1,10.5 v1(284,10.4) 284,10 285.2,8.8 293.6,8.8 294.56,9.76 303.71,9.76 ; D34.5 171.81,123.1 172.95,123.1 ; C15.1 31.3,9.7 31.32,9.69 ; 205.69,63.21 205.69,55.69 ; 205.69,63.21 205.72,63.19 C76.1 ; 205.69,55.69 205.7,55.7 C75.1 ; 205.69,55.69 205.69,52 ; 205.69,137.87 206.66,137.87 206.79,138 D80.5 ; C96.1 308.42,9.77 308.43,9.76 ; 246.1,10.05 246.1,11.19 D70.5 ; 50,150.31 D3.5 ; 50,150.31 53.69,150.31 ; 50,150.31 20,150.31 ; D92.5 348.73,33.26 349.87,33.26 ; 350.22,91.97 D88.5 ; 350.22,91.97 350.22,61.97 ; 303.71,61.86 302.11,60.27 D100.3 ; v1(166,10.2) 165.49,9.69 164.6,9.69 ; 342.01,100.17 D87.5 ; 342.01,100.17 345.7,100.17 ; 271.31,138 272.91,139.6 D61.3 ; 271.31,138 D61.5 ; 75.31,96.79 75.28,96.81 C8.1 ; D54.5 132.9,77.81 132.9,78.95 ; D74.5 207.19,36.9 206.05,36.9 ; 270.95,52.1 269.81,52.1 D66.5 ; 61.21,79.31 61.19,79.28 C28.1 ; 227.32,9.69 227.3,9.7 C71.1 ; 227.32,9.69 219.79,9.69 ; D26.5 34.9,77.81 34.9,78.95 ; 205.69,52 D75.5 ; 9.69,55.69 9.7,55.7 C19.1 ; 9.69,55.69 9.69,52 ; D14.5 50.1,11.19 50.1,10.05 ; 219.79,9.69 219.81,9.72 C72.1 ; 350.22,61.97 D90.5 ; D97.5 303.71,18.16 ; 303.71,18.16 303.71,48.16 ; 303.71,18.16 303.71,16.56 ; C87.1 345.71,100.16 345.7,100.17 ; 20,150.31 D1.5 ; 10.05,36.9 11.19,36.9 D18.5 ; 107.69,123 D51.5 ; 9.69,93 D21.5 ; 9.69,93 9.69,123 ; 9.69,93 8.09,91.4 D21.3 ; 303.71,16.56 303.71,9.76 ; 303.71,16.56 D97.3 ; 303.71,9.76 308.43,9.76 ; 118,79.31 D53.5 ; 261,9.69 D69.5 ; C43.1 129.3,9.7 129.31,9.69 ; 53.69,150.31 53.7,150.3 C3.1 ; 342.12,9.76 D94.5 ; 20,79.31 50,79.31 ; 20,79.31 D25.5 ; 20,79.31 18.4,80.91 D25.3 ; 326.8,53.95 326.8,52.81 D104.5 ; 350.22,49.76 D91.3 ; 50,79.31 D27.5 ; D82.5 230.9,77.81 230.9,78.95 ; D46.5 109.19,36.9 108.05,36.9 ; 303.71,48.16 D99.5 ; 173.31,104.31 173.3,104.3 C35.1 ; 9.69,134.21 9.69,126.69 ; 9.69,134.21 9.72,134.19 C24.1 ; 9.69,126.69 9.69,123 ; 107.69,22 D45.5 ; D98.5 305.2,33.06 304.06,33.06 ; D12.3 78.29,24.59 v1(78.4,24.7) ; D44.5 118.13,11.16 118.13,9.69 ; D6.5 73.81,123.1 74.95,123.1 ; 9.69,52 D19.5 ; 9.69,123 D23.5 ; D95.5 327.21,11.25 327.21,10.12 ; 206.05,107.9 207.19,107.9 D78.5
  Top Layer w1: 173.31,17.51 v1(166,10.2)
  Bottom Layer w0.254: v1(344.3,130.3) 342.01,132.59 v1(339.5,132.59) ; 333.3,115.29 v1(333.3,114.2) v1(333.3,110.3) ; 333.3,115.29 333.07,115.52 330.18,115.52 330.1,115.6 v1(329.1,115.6) ; 333.3,115.29 v1(333.3,117.4) ; 338.95,136.75 v1(336.8,138.9) 334.3,141.4 v1(334,141.4) ; 338.95,136.75 339.5,136.2 v1(339.5,134.2) v1(339.5,132.59) ; 338.95,136.75 v1(338.2,136) ; v1(354.5,127.4) 354.2,127.7 v1(354.2,132.5) ; v1(328.5,122.8) v1(335.2,122.8) ; v1(218.7,9.1) 215.6,9.1 212.74,6.24 H3.5 ; v1(351,118.8) 353.6,121.4 v1(353.6,121.8) ; v1(338.6,114.6) v1(338.6,110.2) v1(338.6,103.2) ; v1(339.23,140.7) v1(339.23,145.2) ; v1(339.5,132.59) 339.5,132.08 v1(338.4,130.98) v1(338.4,127.3) v1(338.4,122.6) ; v1(329,132.9) 330.06,131.84 v1(331.7,131.84)
  Bottom Layer w0.5: v1(166,10.2) 166,10.1 v1(169.4,6.7)
  Bottom Layer w0.508: v1(284,10.4) 270.5,10.4 v1(267.2,13.7) ; v1(78.4,24.7) 83.8,19.3 v1(104.71,19.3)
  Bottom Layer w1: v1(286.1,95.7) 218.5,28.1 183.9,28.1 173.51,17.71 173.5,17.71 v1(173.4,17.61)
